# EAGLE design videobrick_alpha4 (EAGLE 6.6.0)

## Sheet 1 of 3
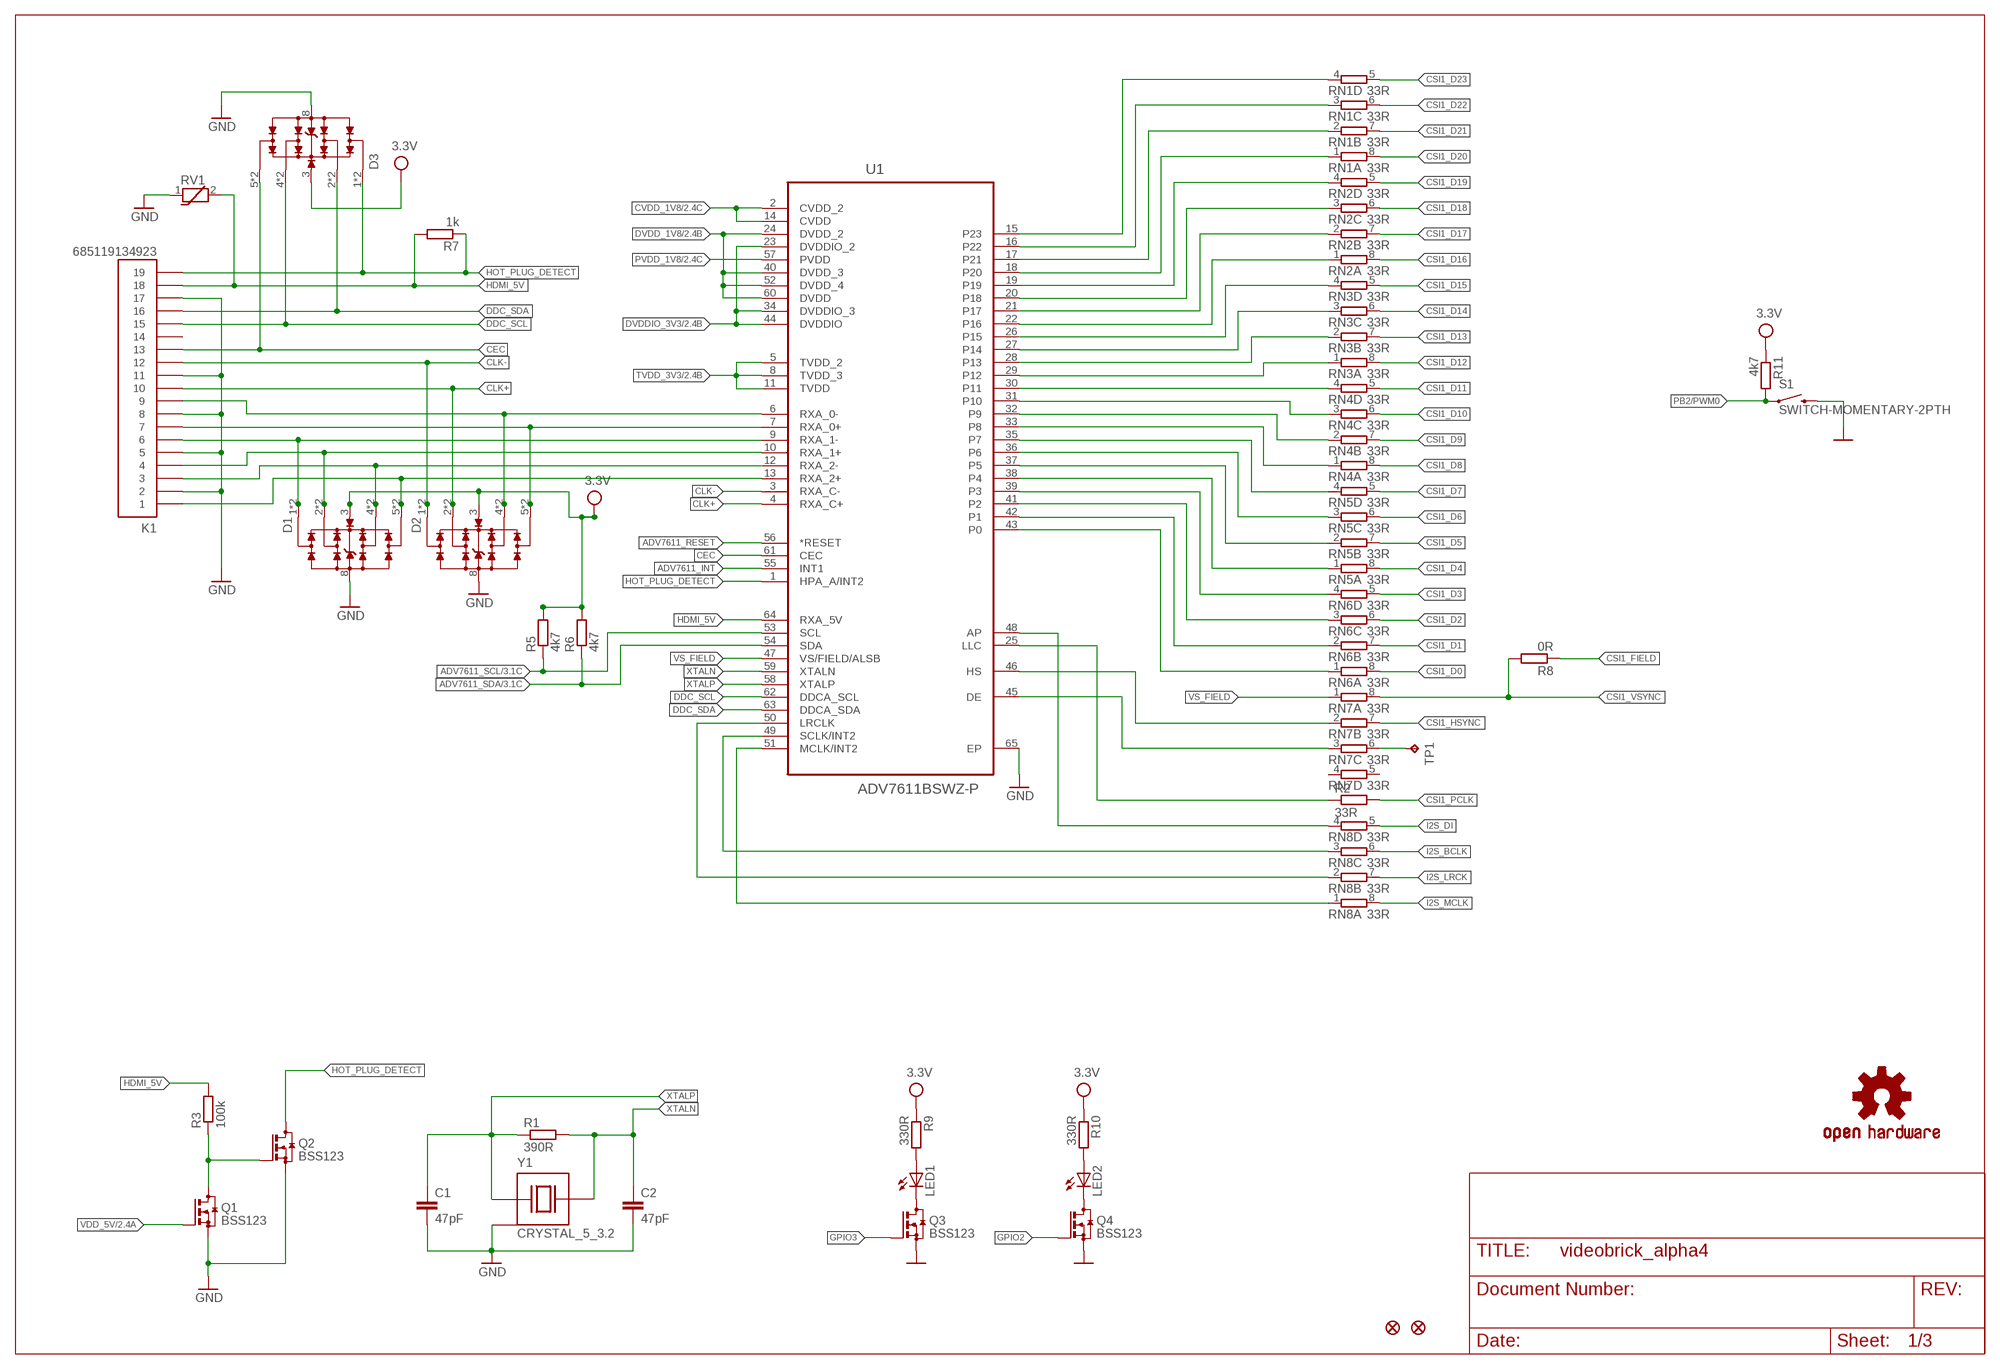
[diagram p0: schematic, sheet 1]

### Parts
C1  47pF  C-EUC0402  [C0402]
C2  47pF  C-EUC0402  [C0402]
D1  WE-TVS_82401444  [WE-TVS_MSOP-10L]
D2  WE-TVS_82401444  [WE-TVS_MSOP-10L]
D3  WE-TVS_82401444  [WE-TVS_MSOP-10L]
FID1  FIDUCIALUFIDUCIAL  [MICRO-FIDUCIAL]
FID2  FIDUCIAL1X2  [FIDUCIAL-1X2]
K1  685119134923  [685119134923]
LED1  LEDCHIPLED_0805  [CHIPLED_0805]
LED2  LEDCHIPLED_0805  [CHIPLED_0805]
LOGO1  OSHW-LOGOL  [OSHW-LOGO-L]
Q1  BSS123  [SOT23]
Q2  BSS123  [SOT23]
Q3  BSS123  [SOT23]
Q4  BSS123  [SOT23]
R1  390R  R-EU_R0402  [R0402]
R2  33R  R-EU_R0402  [R0402]
R3  100k  R-EU_R0402  [R0402]
R5  4k7  R-EU_R0402  [R0402]
R6  4k7  R-EU_R0402  [R0402]
R7  1k  R-EU_R0402  [R0402]
R8  0R  R-EU_R0402  [R0402]
R9  330R  R-EU_R0402  [R0402]
R10  330R  R-EU_R0402  [R0402]
R11  4k7  R-EU_R0402  [R0402]
RN1  33R  4R-N0402ARV341  [4X0402ARV341]
RN2  33R  4R-N0402ARV341  [4X0402ARV341]
RN3  33R  4R-N0402ARV341  [4X0402ARV341]
RN4  33R  4R-N0402ARV341  [4X0402ARV341]
RN5  33R  4R-N0402ARV341  [4X0402ARV341]
RN6  33R  4R-N0402ARV341  [4X0402ARV341]
RN7  33R  4R-N0402ARV341  [4X0402ARV341]
RN8  33R  4R-N0402ARV341  [4X0402ARV341]
RV1  WE-VS-82537040_0402  [WESURGE_0402]
S1  SWITCH-MOMENTARY-2PTH  [TACTILE-PTH]
TP1  TPTP06R  [TP06R]
U1  ADV7611BSWZ-P  [QFP50P1200X1200X160-65N]
Y1  CRYSTAL_5_3.2  [5MM_3.2MM]

### Nets
ADV7611_INT: U1.55(INT1) ; also sheet 3
ADV7611_RESET: U1.56(*RESET) ; also sheet 3
ADV7611_SCL: R5.1 U1.53(SCL) ; also sheet 3
ADV7611_SDA: R6.1 U1.54(SDA) ; also sheet 3
CEC: D3.5 D3.6 K1.13 U1.61(CEC)
CLK+: D2.2 D2.9 K1.10 U1.4(RXA_C+)
CLK-: D2.1 D2.10 K1.12 U1.3(RXA_C-)
CSI1_D0: RN6.8 ; also sheet 3
CSI1_D1: RN6.7 ; also sheet 3
CSI1_D2: RN6.6 ; also sheet 3
CSI1_D3: RN6.5 ; also sheet 3
CSI1_D4: RN5.8 ; also sheet 3
CSI1_D5: RN5.7 ; also sheet 3
CSI1_D6: RN5.6 ; also sheet 3
CSI1_D7: RN5.5 ; also sheet 3
CSI1_D8: RN4.8 ; also sheet 3
CSI1_D9: RN4.7 ; also sheet 3
CSI1_D10: RN4.6 ; also sheet 3
CSI1_D11: RN4.5 ; also sheet 3
CSI1_D12: RN3.8 ; also sheet 3
CSI1_D13: RN3.7 ; also sheet 3
CSI1_D14: RN3.6 ; also sheet 3
CSI1_D15: RN3.5 ; also sheet 3
CSI1_D16: RN2.8 ; also sheet 3
CSI1_D17: RN2.7 ; also sheet 3
CSI1_D18: RN2.6 ; also sheet 3
CSI1_D19: RN2.5 ; also sheet 3
CSI1_D20: RN1.8 ; also sheet 3
CSI1_D21: RN1.7 ; also sheet 3
CSI1_D22: RN1.6 ; also sheet 3
CSI1_D23: RN1.5 ; also sheet 3
CSI1_FIELD: R8.1 ; also sheet 3
CSI1_HSYNC: RN7.7 ; also sheet 3
CSI1_PCLK: R2.2 ; also sheet 3
CSI1_VSYNC: R8.2 RN7.8 ; also sheet 3
CVDD_1V8: U1.2(CVDD_2) U1.14(CVDD) ; also sheet 2
DDC_SCL: D3.4 D3.7 K1.15 U1.62(DDCA_SCL)
DDC_SDA: D3.2 D3.9 K1.16 U1.63(DDCA_SDA)
DVDD_1V8: U1.24(DVDD_2) U1.40(DVDD_3) U1.52(DVDD_4) U1.60(DVDD) ; also sheet 2
DVDDIO_3V3: U1.23(DVDDIO_2) U1.34(DVDDIO_3) U1.44(DVDDIO) ; also sheet 2
GND: C1.2 C2.2 D1.8(GND) D2.8(GND) D3.8(GND) K1.2 K1.5 K1.8 K1.11 K1.17 Q1.2(S) Q2.2(S) Q3.2(S) Q4.2(S) RV1.1 S1.3 U1.65(EP) Y1.P$2 Y1.P$4# ; also sheet 2,3
GPIO2: Q4.1(G) ; also sheet 3
GPIO3: Q3.1(G) ; also sheet 3
HDMI_5V: K1.18 R3.2 R7.2 RV1.2 U1.64(RXA_5V)
HOT_PLUG_DETECT: D3.1 D3.10 K1.19 Q2.3(D) R7.1 U1.1(HPA_A/INT2)
I2S_BCLK: RN8.6 ; also sheet 3
I2S_DI: RN8.5 ; also sheet 3
I2S_LRCK: RN8.7 ; also sheet 3
I2S_MCLK: RN8.8 ; also sheet 3
N$1: D1.5 D1.6 K1.1 U1.13(RXA_2+)
N$2: D1.4 D1.7 K1.3 U1.12(RXA_2-)
N$3: D1.2 D1.9 K1.4 U1.10(RXA_1+)
N$4: D1.1 D1.10 K1.6 U1.9(RXA_1-)
N$5: D2.5 D2.6 K1.7 U1.7(RXA_0+)
N$6: D2.4 D2.7 K1.9 U1.6(RXA_0-)
N$7: RN1.4 U1.15(P23)
N$8: RN1.3 U1.16(P22)
N$9: RN1.2 U1.17(P21)
N$10: RN1.1 U1.18(P20)
N$11: RN2.4 U1.19
N$12: RN2.3 U1.20(P18)
N$13: RN2.2 U1.21(P17)
N$14: RN2.1 U1.22(P16)
N$15: RN3.4 U1.26(P15)
N$16: RN3.3 U1.27(P14)
N$17: RN3.2 U1.28(P13)
N$18: RN3.1 U1.29(P12)
N$19: RN4.4 U1.30(P11)
N$20: RN4.3 U1.31(P10)
N$21: RN4.2 U1.32(P9)
N$22: RN4.1 U1.33(P8)
N$23: RN5.4 U1.35(P7)
N$24: RN5.3 U1.36(P6)
N$25: RN5.2 U1.37(P5)
N$26: RN5.1 U1.38(P4)
N$27: RN6.4 U1.39(P3)
N$28: RN6.3 U1.41(P2)
N$29: RN6.2 U1.42(P1)
N$30: RN6.1 U1.43(P0)
N$31: RN8.4 U1.48(AP)
N$32: RN7.2 U1.46(HS)
N$33: RN7.3 U1.45(DE)
N$34: R2.1 U1.25(LLC)
N$35: RN8.3 U1.49(SCLK/INT2)
N$36: Q1.3(D) Q2.1(G) R3.1
N$37: RN8.2 U1.50(LRCLK)
N$38: RN8.1 U1.51(MCLK/INT2)
N$40: LED1.C Q3.3(D)
N$41: LED1.A R9.2
N$43: LED2.A R10.2
N$44: LED2.C Q4.3(D)
N$47: RN7.6 TP1.TP
PB2/PWM0: R11.2 S1.1 ; also sheet 3
PVDD_1V8: U1.57(PVDD) ; also sheet 2
TVDD_3V3: U1.5(TVDD_2) U1.8(TVDD_3) U1.11(TVDD) ; also sheet 2
VCC: D1.3(VDD) D2.3(VDD) D3.3(VDD) R5.2 R6.2 R9.1 R10.1 R11.1 ; supply symbol labelled 3.3V ; also sheet 2,3
VDD_5V: Q1.1(G) ; also sheet 2
VS_FIELD: RN7.1 U1.47(VS/FIELD/ALSB)
XTALN: C2.1 R1.2 U1.59(XTALN) Y1.P$3
XTALP: C1.1 R1.1 U1.58(XTALP) Y1.P$1
Unconnected: K1.14 RN7.4 RN7.5

## Sheet 2 of 3: Power
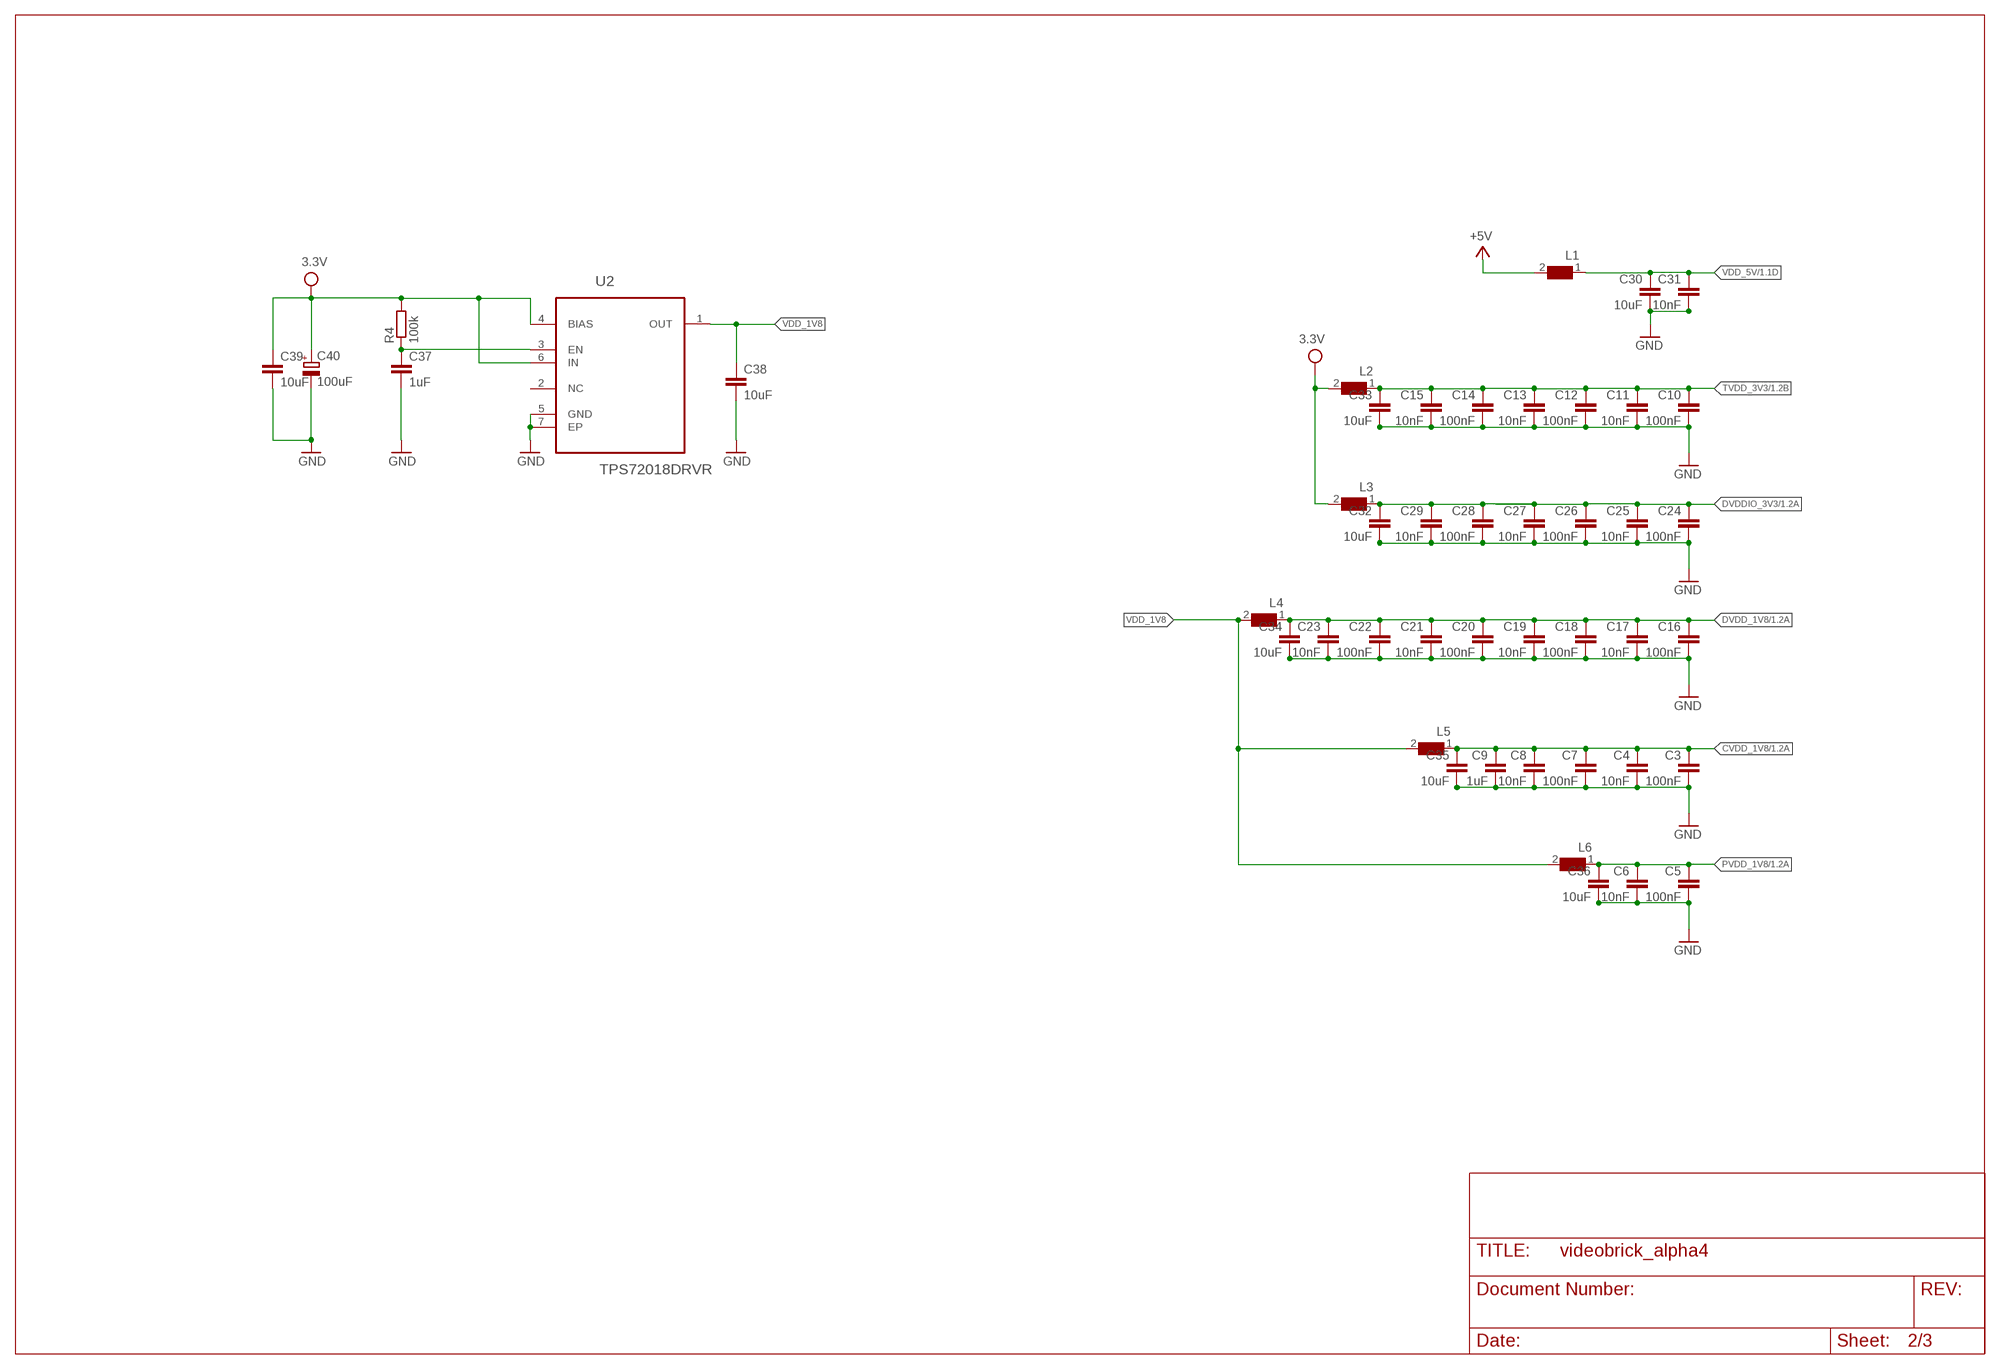
[diagram p1: schematic, sheet 2]

### Parts
C3  100nF  C-EUC0402  [C0402]
C4  10nF  C-EUC0402  [C0402]
C5  100nF  C-EUC0402  [C0402]
C6  10nF  C-EUC0402  [C0402]
C7  100nF  C-EUC0402  [C0402]
C8  10nF  C-EUC0402  [C0402]
C9  1uF  C-EUC0603  [C0603]
C10  100nF  C-EUC0402  [C0402]
C11  10nF  C-EUC0402  [C0402]
C12  100nF  C-EUC0402  [C0402]
C13  10nF  C-EUC0402  [C0402]
C14  100nF  C-EUC0402  [C0402]
C15  10nF  C-EUC0402  [C0402]
C16  100nF  C-EUC0402  [C0402]
C17  10nF  C-EUC0402  [C0402]
C18  100nF  C-EUC0402  [C0402]
C19  10nF  C-EUC0402  [C0402]
C20  100nF  C-EUC0402  [C0402]
C21  10nF  C-EUC0402  [C0402]
C22  100nF  C-EUC0402  [C0402]
C23  10nF  C-EUC0402  [C0402]
C24  100nF  C-EUC0402  [C0402]
C25  10nF  C-EUC0402  [C0402]
C26  100nF  C-EUC0402  [C0402]
C27  10nF  C-EUC0402  [C0402]
C28  100nF  C-EUC0402  [C0402]
C29  10nF  C-EUC0402  [C0402]
C30  10uF  C-EUC0805  [C0805]
C31  10nF  C-EUC0402  [C0402]
C32  10uF  C-EUC0805  [C0805]
C33  10uF  C-EUC0805  [C0805]
C34  10uF  C-EUC0805  [C0805]
C35  10uF  C-EUC0805  [C0805]
C36  10uF  C-EUC0805  [C0805]
C37  1uF  C-EUC0603  [C0603]
C38  10uF  C-EUC0805  [C0805]
C39  10uF  C-EUC0805  [C0805]
C40  100uF  CPOL-EU153CLV-0405  [153CLV-0405]
L1  WE-CBF-742792040_0805  [0805]
L2  WE-CBF-742792040_0805  [0805]
L3  WE-CBF-742792040_0805  [0805]
L4  WE-CBF-742792040_0805  [0805]
L5  WE-CBF-742792040_0805  [0805]
L6  WE-CBF-742792040_0805  [0805]
R4  100k  R-EU_R0402  [R0402]
U2  TPS72018DRVR  [SON65P200X200X80-7N]

### Nets
+5V: L1.2 ; also sheet 3
CVDD_1V8: C3.1 C4.1 C7.1 C8.1 C9.1 C35.1 L5.1 ; also sheet 1
DVDD_1V8: C16.1 C17.1 C18.1 C19.1 C20.1 C21.1 C22.1 C23.1 C34.1 L4.1 ; also sheet 1
DVDDIO_3V3: C24.1 C25.1 C26.1 C27.1 C28.1 C29.1 C32.1 L3.1 ; also sheet 1
GND: C3.2 C4.2 C5.2 C6.2 C7.2 C8.2 C9.2 C10.2 C11.2 C12.2 C13.2 C14.2 C15.2 C16.2 C17.2 C18.2 C19.2 C20.2 C21.2 C22.2 C23.2 C24.2 C25.2 C26.2 C27.2 C28.2 C29.2 C30.2 C31.2 C32.2 C33.2 C34.2 C35.2 C36.2 C37.2 C38.2 C39.2 C40.- U2.5(GND) U2.7(EP) ; also sheet 1,3
N$39: C37.1 R4.1 U2.3(EN)
PVDD_1V8: C5.1 C6.1 C36.1 L6.1 ; also sheet 1
TVDD_3V3: C10.1 C11.1 C12.1 C13.1 C14.1 C15.1 C33.1 L2.1 ; also sheet 1
VCC: C39.1 C40.+ L2.2 L3.2 R4.2 U2.4(BIAS) U2.6(IN) ; supply symbol labelled 3.3V ; also sheet 1,3
VDD_1V8: C38.1 L4.2 L5.2 L6.2 U2.1(OUT)
VDD_5V: C30.1 C31.1 L1.1 ; also sheet 1
Unconnected: U2.2(NC)

## Sheet 3 of 3: Connector
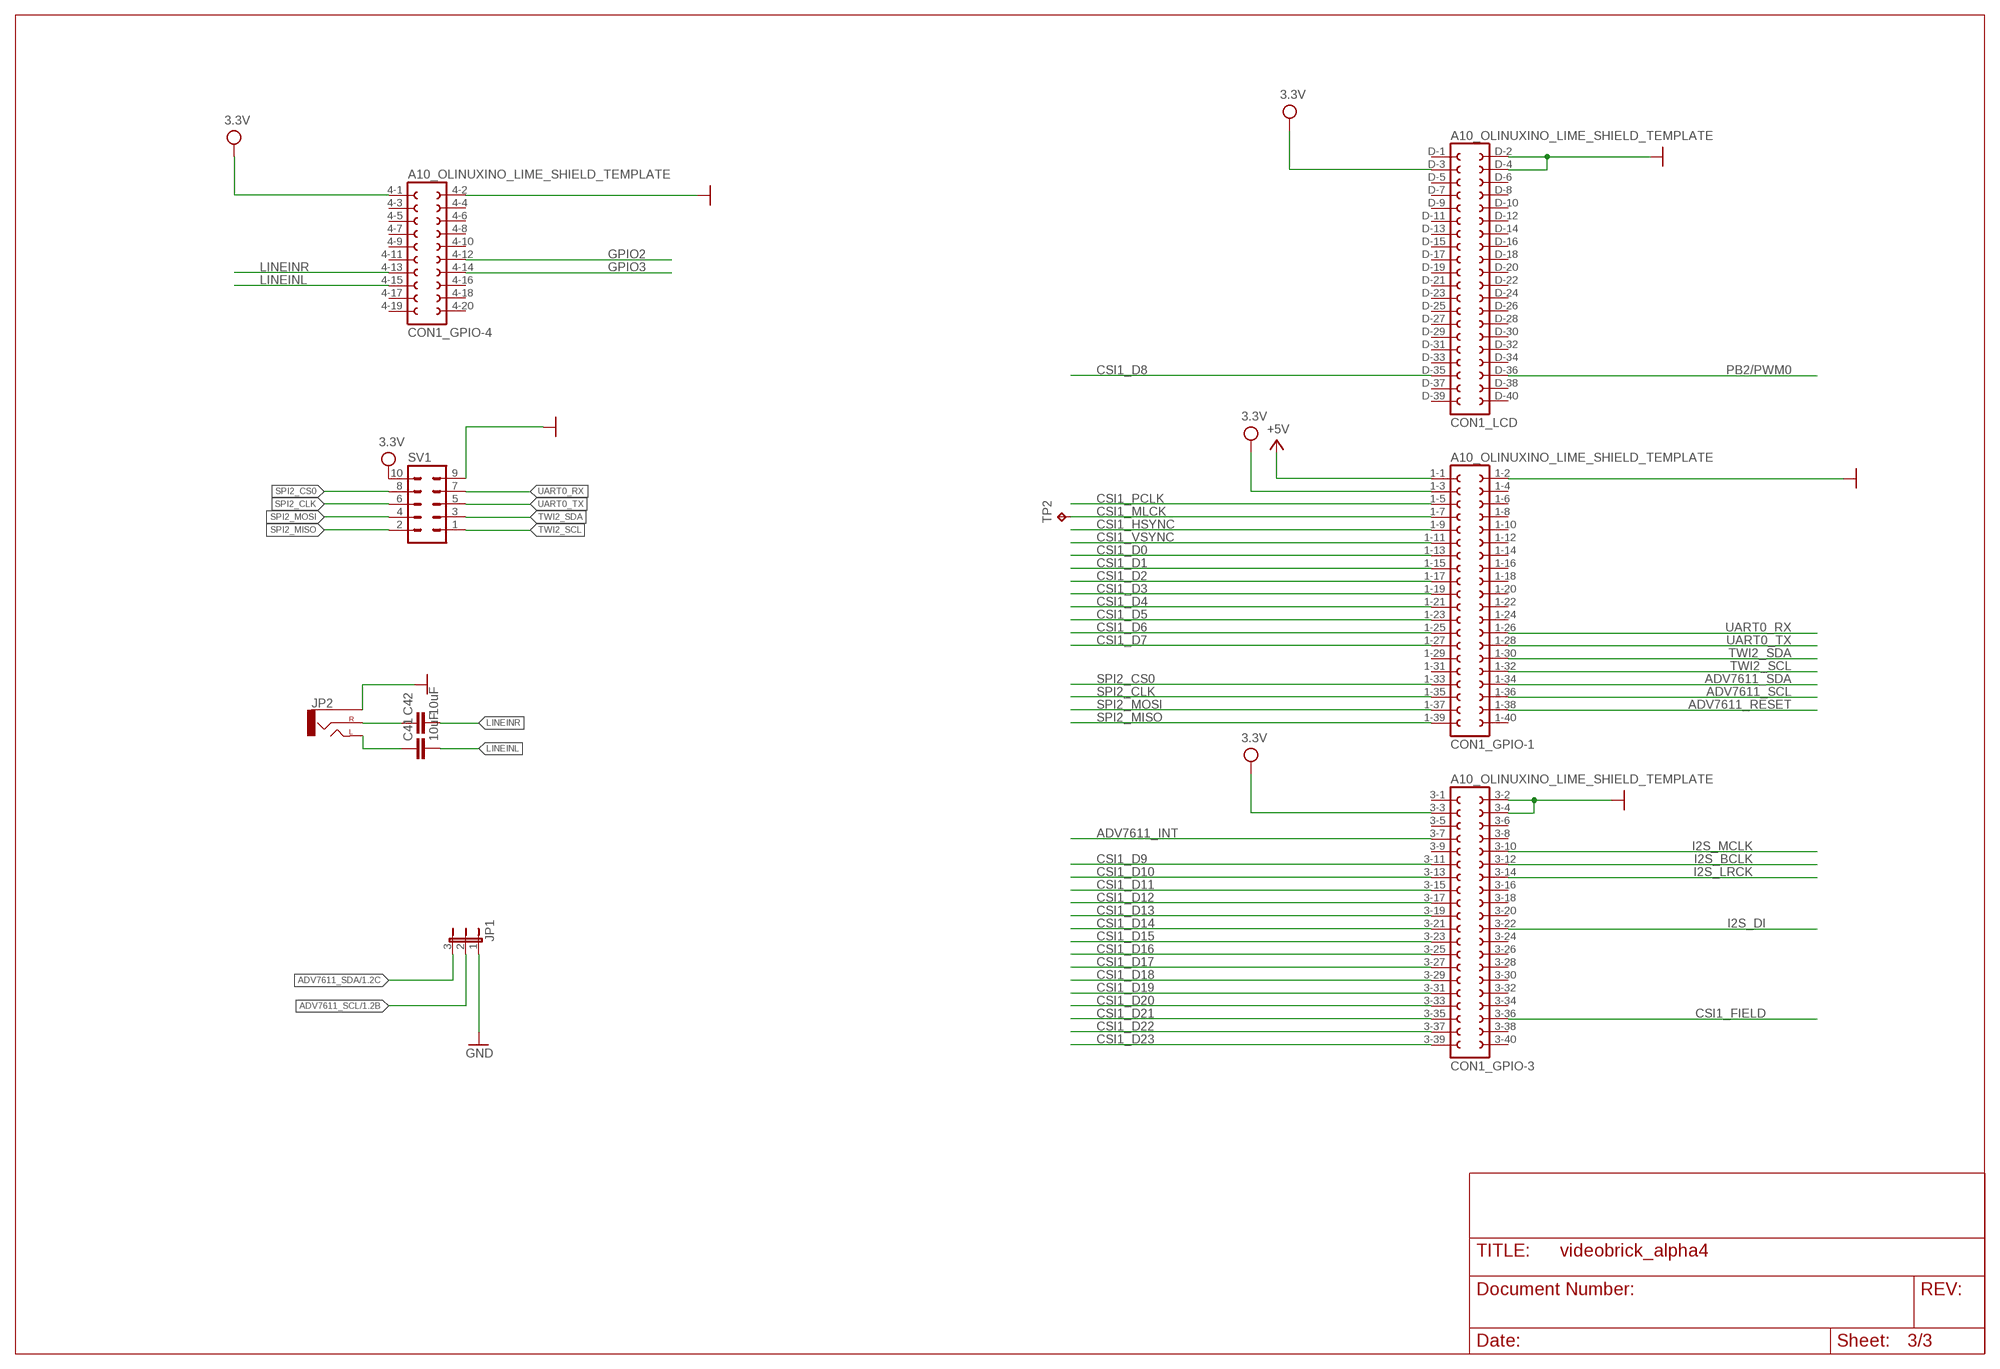
[diagram p2: schematic, sheet 3]

### Parts
C41  10uF  C-EUC0805  [C0805]
C42  10uF  C-EUC0805  [C0805]
CON1  A10_OLINUXINO_LIME_SHIELD_TEMPLATE  [A10_OLINUXINO_LIME_SHIELD]
JP1  JP2E  [JP2]
JP2  AUDIO-JACKPTH  [AUDIO-JACK]
SV1  MA05-2  [MA05-2]
TP2  TPTP06R  [TP06R]

### Nets
+5V: CON1.1-1 ; also sheet 2
ADV7611_INT: CON1.3-7 ; also sheet 1
ADV7611_RESET: CON1.1-38 ; also sheet 1
ADV7611_SCL: CON1.1-36 JP1.2 ; also sheet 1
ADV7611_SDA: CON1.1-34 JP1.3 ; also sheet 1
CSI1_D0: CON1.1-13 ; also sheet 1
CSI1_D1: CON1.1-15 ; also sheet 1
CSI1_D2: CON1.1-17 ; also sheet 1
CSI1_D3: CON1.1-19 ; also sheet 1
CSI1_D4: CON1.1-21 ; also sheet 1
CSI1_D5: CON1.1-23 ; also sheet 1
CSI1_D6: CON1.1-25 ; also sheet 1
CSI1_D7: CON1.1-27 ; also sheet 1
CSI1_D8: CON1.D-35 ; also sheet 1
CSI1_D9: CON1.3-11 ; also sheet 1
CSI1_D10: CON1.3-13 ; also sheet 1
CSI1_D11: CON1.3-15 ; also sheet 1
CSI1_D12: CON1.3-17 ; also sheet 1
CSI1_D13: CON1.3-19 ; also sheet 1
CSI1_D14: CON1.3-21 ; also sheet 1
CSI1_D15: CON1.3-23 ; also sheet 1
CSI1_D16: CON1.3-25 ; also sheet 1
CSI1_D17: CON1.3-27 ; also sheet 1
CSI1_D18: CON1.3-29 ; also sheet 1
CSI1_D19: CON1.3-31 ; also sheet 1
CSI1_D20: CON1.3-33 ; also sheet 1
CSI1_D21: CON1.3-35 ; also sheet 1
CSI1_D22: CON1.3-37 ; also sheet 1
CSI1_D23: CON1.3-39 ; also sheet 1
CSI1_FIELD: CON1.3-36 ; also sheet 1
CSI1_HSYNC: CON1.1-9 ; also sheet 1
CSI1_MLCK: CON1.1-7 TP2.TP
CSI1_PCLK: CON1.1-5 ; also sheet 1
CSI1_VSYNC: CON1.1-11 ; also sheet 1
GND: CON1.1-2 CON1.3-2 CON1.3-4 CON1.4-2 CON1.D-2 CON1.D-4 JP1.1 JP2.SLEEVE SV1.9 ; also sheet 1,2
GPIO2: CON1.4-12 ; also sheet 1
GPIO3: CON1.4-14 ; also sheet 1
I2S_BCLK: CON1.3-12 ; also sheet 1
I2S_DI: CON1.3-22 ; also sheet 1
I2S_LRCK: CON1.3-14 ; also sheet 1
I2S_MCLK: CON1.3-10 ; also sheet 1
LINEINL: C41.2 CON1.4-15
LINEINR: C42.2 CON1.4-13
N$45: C42.1 JP2.RING(RIGHT)
N$46: C41.1 JP2.TIP(LEFT)
PB2/PWM0: CON1.D-36 ; also sheet 1
SPI2_CLK: CON1.1-35 SV1.6
SPI2_CS0: CON1.1-33 SV1.8
SPI2_MISO: CON1.1-39 SV1.2
SPI2_MOSI: CON1.1-37 SV1.4
TWI2_SCL: CON1.1-32 SV1.1
TWI2_SDA: CON1.1-30 SV1.3
UART0_RX: CON1.1-26 SV1.7
UART0_TX: CON1.1-28 SV1.5
VCC: CON1.1-3 CON1.3-3 CON1.4-1 CON1.D-3 SV1.10 ; supply symbol labelled 3.3V ; also sheet 1,2
Unconnected: CON1.1-4 CON1.1-6 CON1.1-8 CON1.1-10 CON1.1-12 CON1.1-14 CON1.1-16 CON1.1-18 CON1.1-20 CON1.1-22 CON1.1-24 CON1.1-29 CON1.1-31 CON1.1-40 CON1.3-1 CON1.3-5 CON1.3-6 CON1.3-8 CON1.3-9 CON1.3-16 CON1.3-18 CON1.3-20 CON1.3-24 CON1.3-26 CON1.3-28 CON1.3-30 CON1.3-32 CON1.3-34 CON1.3-38 CON1.3-40 CON1.4-3 CON1.4-4 CON1.4-5 CON1.4-6 CON1.4-7 CON1.4-8 CON1.4-9 CON1.4-10 CON1.4-11 CON1.4-16 CON1.4-17 CON1.4-18 CON1.4-19 CON1.4-20 CON1.D-1 CON1.D-5 CON1.D-6 CON1.D-7 CON1.D-8 CON1.D-9 CON1.D-10 CON1.D-11 CON1.D-12 CON1.D-13 CON1.D-14 CON1.D-15 CON1.D-16 CON1.D-17 CON1.D-18 CON1.D-19 CON1.D-20 CON1.D-21 CON1.D-22 CON1.D-23 CON1.D-24 CON1.D-25 CON1.D-26 CON1.D-27 CON1.D-28 CON1.D-29 CON1.D-30 CON1.D-31 CON1.D-32 CON1.D-33 CON1.D-34 CON1.D-37 CON1.D-38 CON1.D-39 CON1.D-40

## Library data of the parts
C1-C39 C41 C42 = rcl:C-EU: CAPACITOR, European symbol
C40 = rcl:CPOL-EU: POLARIZED CAPACITOR, European symbol
CON1 = A10_OLIMEXINO_LIME_SHIELD:A10_OLINUXINO_LIME_SHIELD_TEMPLATE
D1-D3 = WE-TVS_82401444:WE-TVS_82401444: TVS Diode Array WE-TVS, Super Speed Serie - Low capazity - No leakage current - Low clamping voltage - high ESD voltage protection -- SATA -- DisplayPort -- DVI -- HDMI; MPN: 82401444; OC_FARNELL: 1825863; OC_NEWARK: 79R6952; PACKAGE: MSOP-10L; SUPPLIER: Wuerth Elektronik
FID1 FID2 = SparkFun-Aesthetics:FIDUCIAL: Fiducial Alignment Points Various fiducial points for machine vision alignment.
JP1 = jumper:JP2E: JUMPER
JP2 = SparkFun-Connectors:AUDIO-JACK: 3.5mm Audio Jack Simple 3.5mm common PCB mount audio jack. SKU: PRT-08032
K1 = InputOutputIO:685119134923: WR-COM SMT Horizontal HDMI, 19 pins
L1-L6 = WE-CBF:WE-CBF: SMD EMI Suppression Ferrite Beads WE-CBF - Excellent anti-EMI properties - Low DC-restistance - Impedances till 3000 ohms - Rated current up to 6 A -- Reliable Ni-Sn electrodes -- Perfect as data lined filter and for uncoupling of distribution voltage; MPN: 742792040; OC_FARNELL: 1635735; OC_NEWARK: 08P2371; PACKAGE: IND-0805; SUPPLIER: Wuerth Elektronik
LED1 LED2 = led:LED: LED OSRAM: - CHIPLED LG R971, LG N971, LY N971, LG Q971, LY Q971, LO R971, LY R971 LH N974, LH R974 LS Q976, LO Q976, LY Q976 LO Q996 - Hyper CHIPLED LW Q18S LB Q993, LB Q99A, LB R99A - SideLED LS A670, LO A670, LY A670, LG A670, LP A670 LB A673, LV A673, LT A673, LW A673 LH A674 LY A675 LS A676, LA A676, LO A676, LY A676, LW A676 LS A679, LY A679, LG A679 - Hyper Micro SIDELED® LS Y876, LA Y876, LO Y876, LY Y876 LT Y87S - SmartLED LW L88C, LW L88S LB L89C, LB L89S, LG L890 LS L89K, LO L89K, LY L89K LS L896, LA L896, LO L896, LY L896 - TOPLED LS T670, LO T670, LY T670, LG T670, LP T670 LSG T670, LSP T670, LSY T670, LOP T670, LYG T670 LG T671, LOG T671, LSG T671 LB T673, LV T673, LT T673, LW T673 LH T674 LS T676, LA T676, LO T676, LY T676, LB T676, LH T676, LSB T676, LW T676 LB T67C, LV T67C, LT T67C, LS T67K, LO T67K, LY T67K, LW E67C LS E67B, LA E67B, LO E67B, LY E67B, LB E67C, LV E67C, LT E67C LW T67C LS T679, LY T679, LG T679 LS T770, LO T770, LY T770, LG T770, LP T770 LB T773, LV T773, LT T773, LW T773 LH T774 LS E675, LA E675, LY E675, LS T675 LS T776, LA T776, LO T776, LY T776, LB T776 LHGB T686 LT T68C, LB T68C - Hyper Mini TOPLED® LB M676 - Mini TOPLED Santana® LG M470 LS M47K, LO M47K, LY M47K Source: http://www.osram.convergy.de LUXEON: - LUMILED® LXK2-PW12-R00, LXK2-PW12-S00, LXK2-PW14-U00, LXK2-PW14-V00 LXK2-PM12-R00, LXK2-PM12-S00, LXK2-PM14-U00 LXK2-PE12-Q00, LXK2-PE12-R00, LXK2-PE12-S00, LXK2-PE14-T00, LXK2-PE14-U00 LXK2-PB12-K00, LXK2-PB12-L00, LXK2-PB12-M00, LXK2-PB14-N00, LXK2-PB14-P00, LXK2-PB14-Q00 LXK2-PR12-L00, LXK2-PR12-M00, LXK2-PR14-Q00, LXK2-PR14-R00 LXK2-PD12-Q00, LXK2-PD12-R00, LXK2-PD12-S00 LXK2-PH12-R00, LXK2-PH12-S00 LXK2-PL12-P00, LXK2-PL12-Q00, LXK2-PL12-R00 Source: www.luxeon.com KINGBRIGHT: KA-3528ASYC Source: www.kingbright.com
LOGO1 = SparkFun-Aesthetics:OSHW-LOGO: Open Source Hardware Logo This logo indicates the piece of hardware it is found on incorporates a OSHW license and/or adheres to the definition of open source hardware found here: http://freedomdefined.org/OSHW
Q1-Q4 = transistor-small-signal:BSS123: N-CHANNEL MOS FET
R1-R11 = resistor:R-EU_: RESISTOR, European symbol
RN1-RN8 = resistor-dil:4R-N: Array Chip Resistor Source: RS Component / Phycomp; OC_FARNELL: unknown; OC_NEWARK: unknown
RV1 = WE-VS:WE-VS: WESURGE SMD Varistor WE-VS - Fast response time - Low leakage current - Low clamping voltage - Wide range of voltage avaible - Almost no energy consumption in stand-by mode - Excellent absorption at surge-impulses - Nickel barrier for leadfree soldering - Operating temperature: -40°C to +85°C for size 0402 to 0805; -40°C to +1255°C for size 1206 to 2220 -- Protection of DC distribution -- Protection of power supply -- Protection of semiconductors -- Protection of bus systems and communication lines -- Limiting of over-voltage -- ESD protection in accordance with EN 61000-4-2 and Surge protection in accordance with EN 61000-4-5; MPN: 82537040; OC_FARNELL: 1636429; OC_NEWARK: 08P3016; PACKAGE: 0402; SUPPLIER: WURTH ELEKTRONIK
S1 = SparkFun-Electromechanical:SWITCH-MOMENTARY-2: Various NO switches- pushbuttons, reed, etc
SV1 = con-lstb:MA05-2: PIN HEADER; OC_FARNELL: unknown; OC_NEWARK: unknown
TP1 TP2 = testpad:TP: Test pad
U1 = ADI-Phase-2:ADV7611BSWZ-P: Low Power 165 MHz HDMI Receiver,LQFP-64; MPN: ADV7611BSWZ-P; OC_FARNELL: 1903660; OC_NEWARK: 45T0201; PACKAGE: LQFP-64; SUPPLIER: Analog Devices
U2 = Texas Instruments_By_element14_Batch_1:TPS72018DRVR: 350mA, Ultra-Low VIN, RF Low-Dropout Linear Regulator with Bias Pin; MPN: TPS72018DRVR; OC_FARNELL: -; OC_NEWARK: 69R0453; PACKAGE: SON-6; SUPPLIER: Texas Instruments
Y1 = xtals:CRYSTAL_5_3.2

## Board
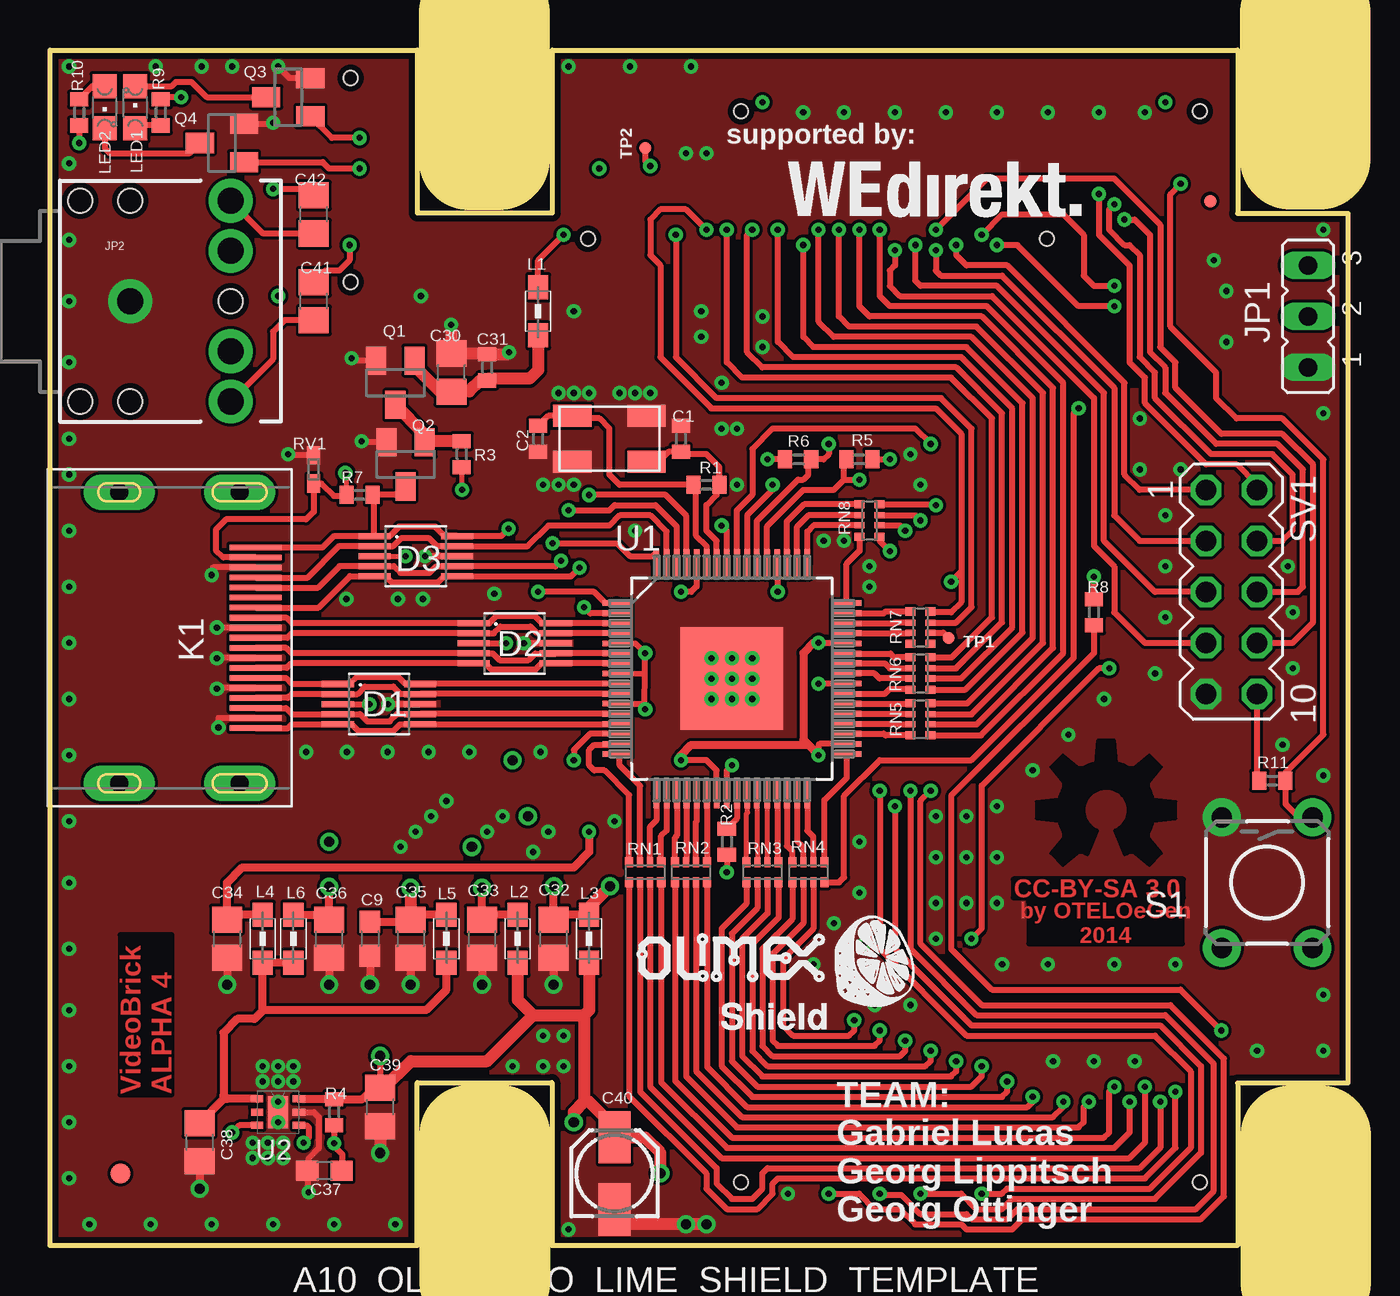
[diagram p3: board, top side]
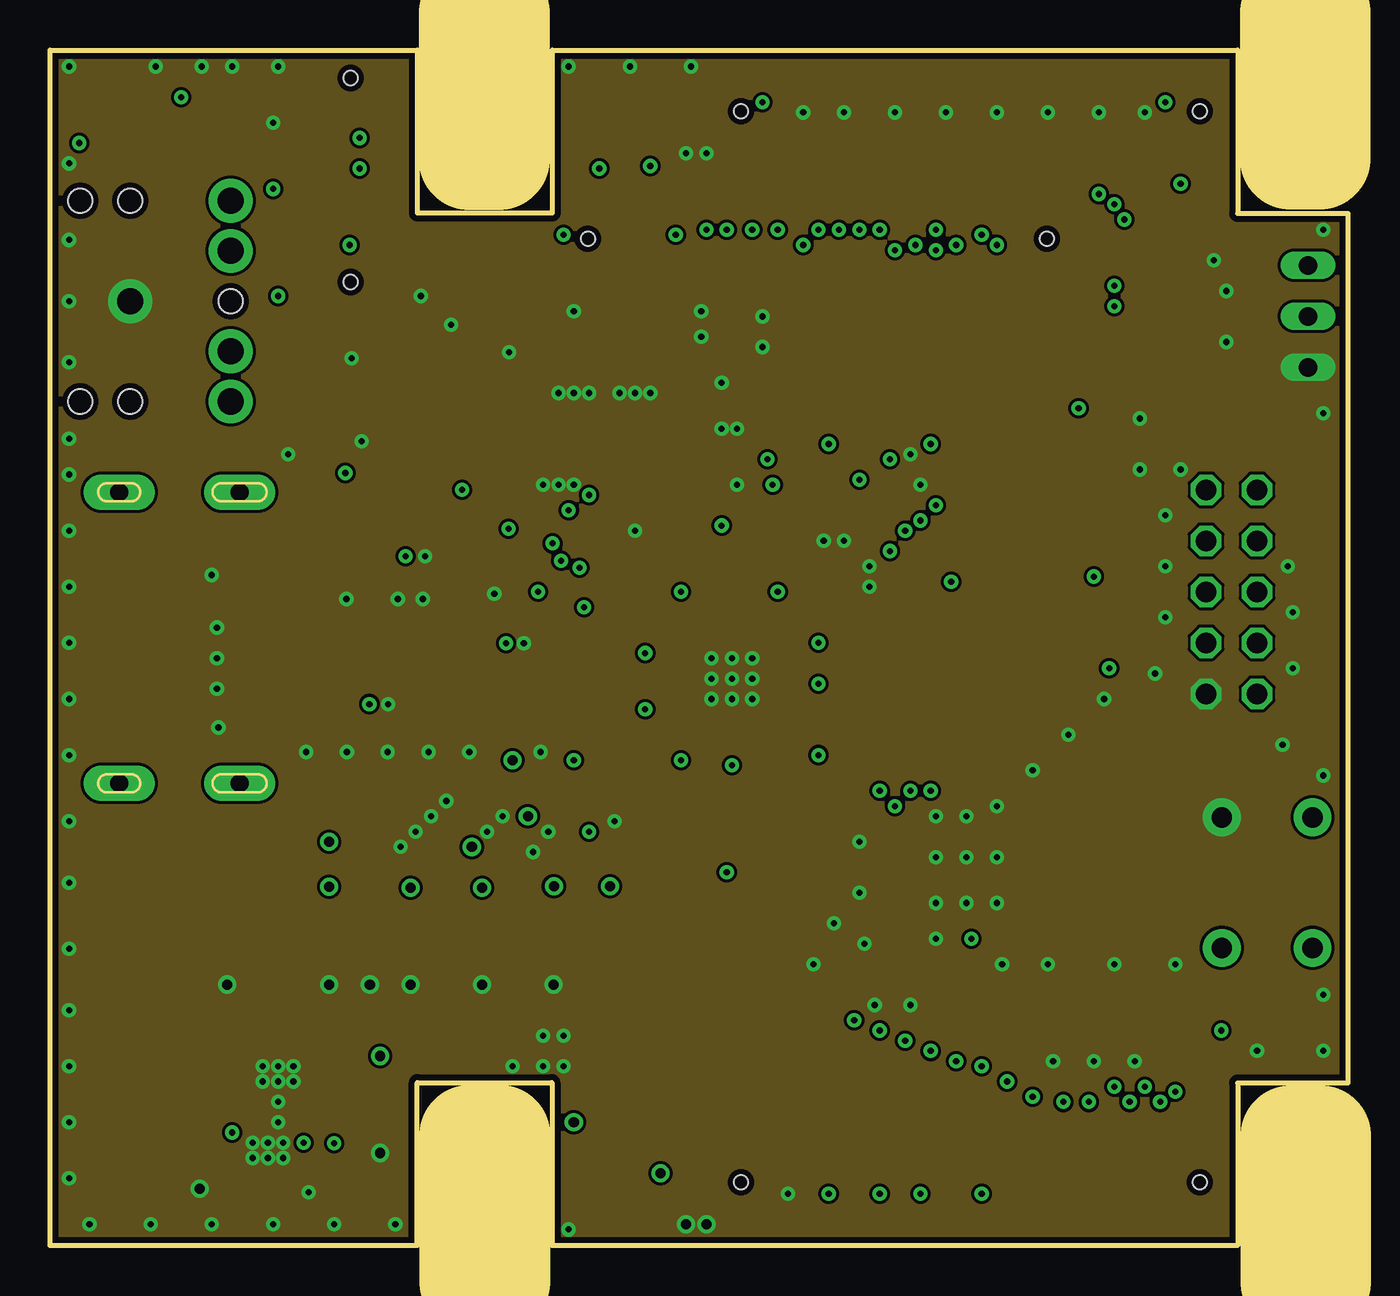
[diagram p4: board, inner layer Route2]
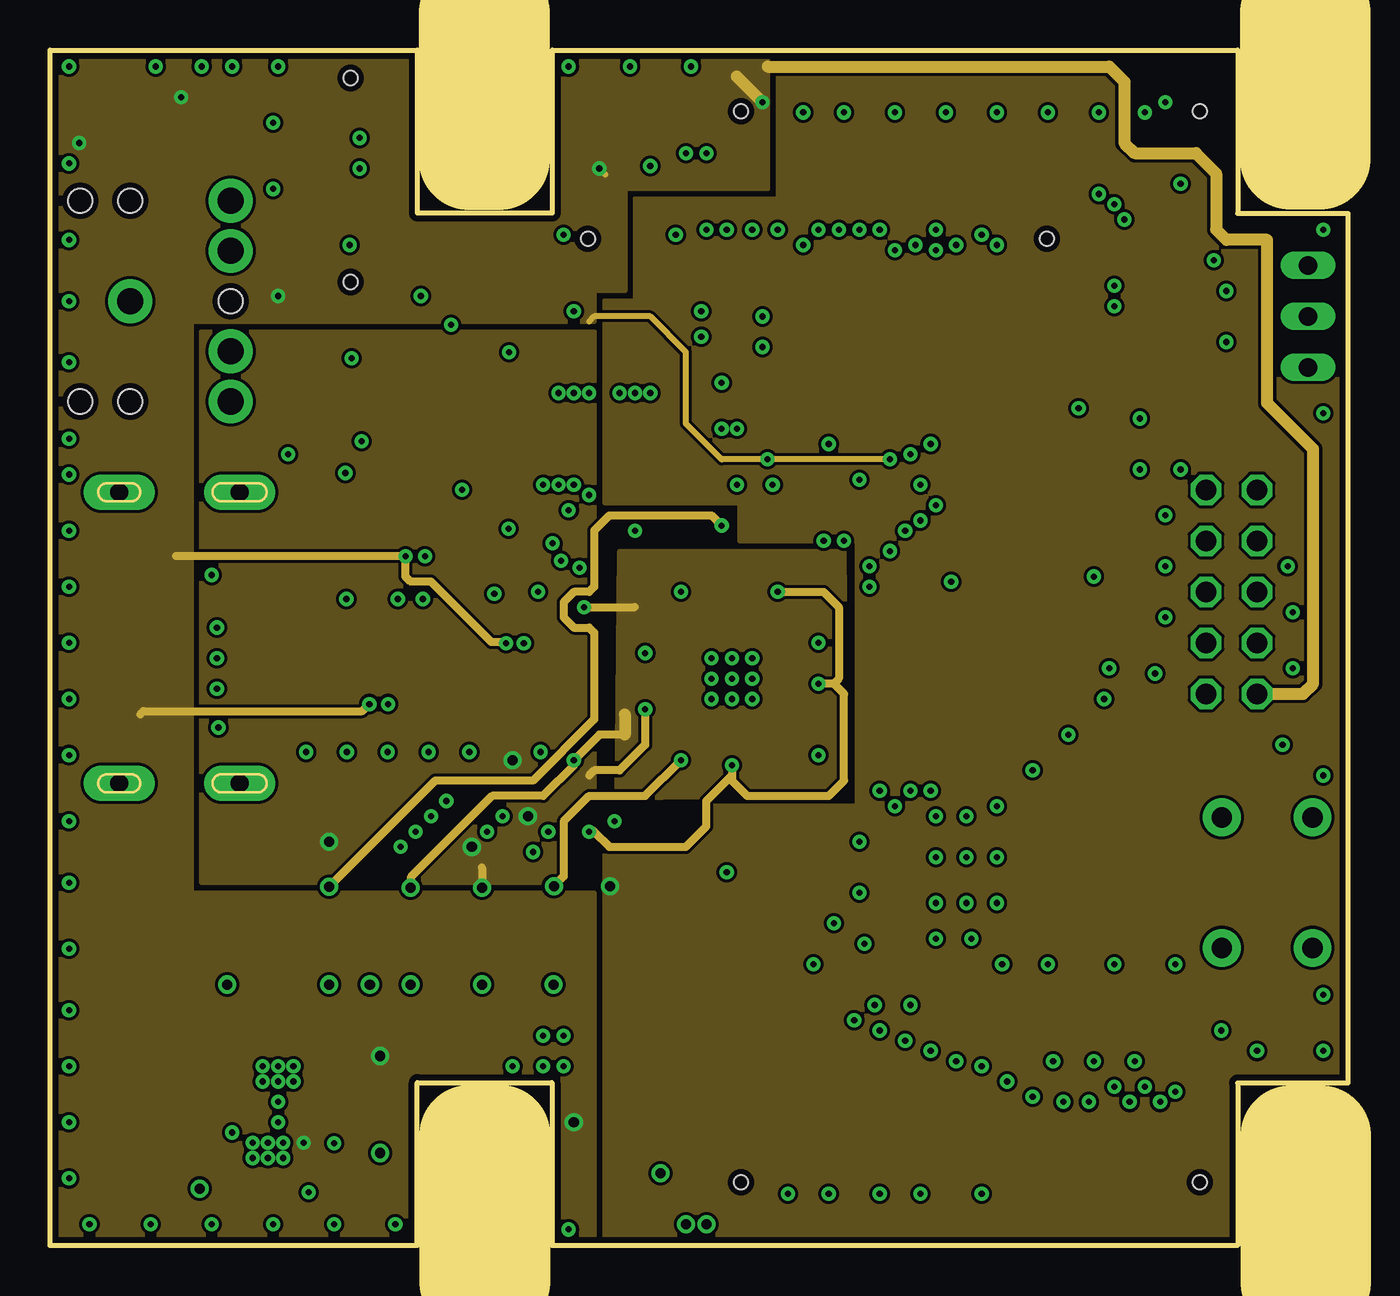
[diagram p5: board, inner layer Route15]
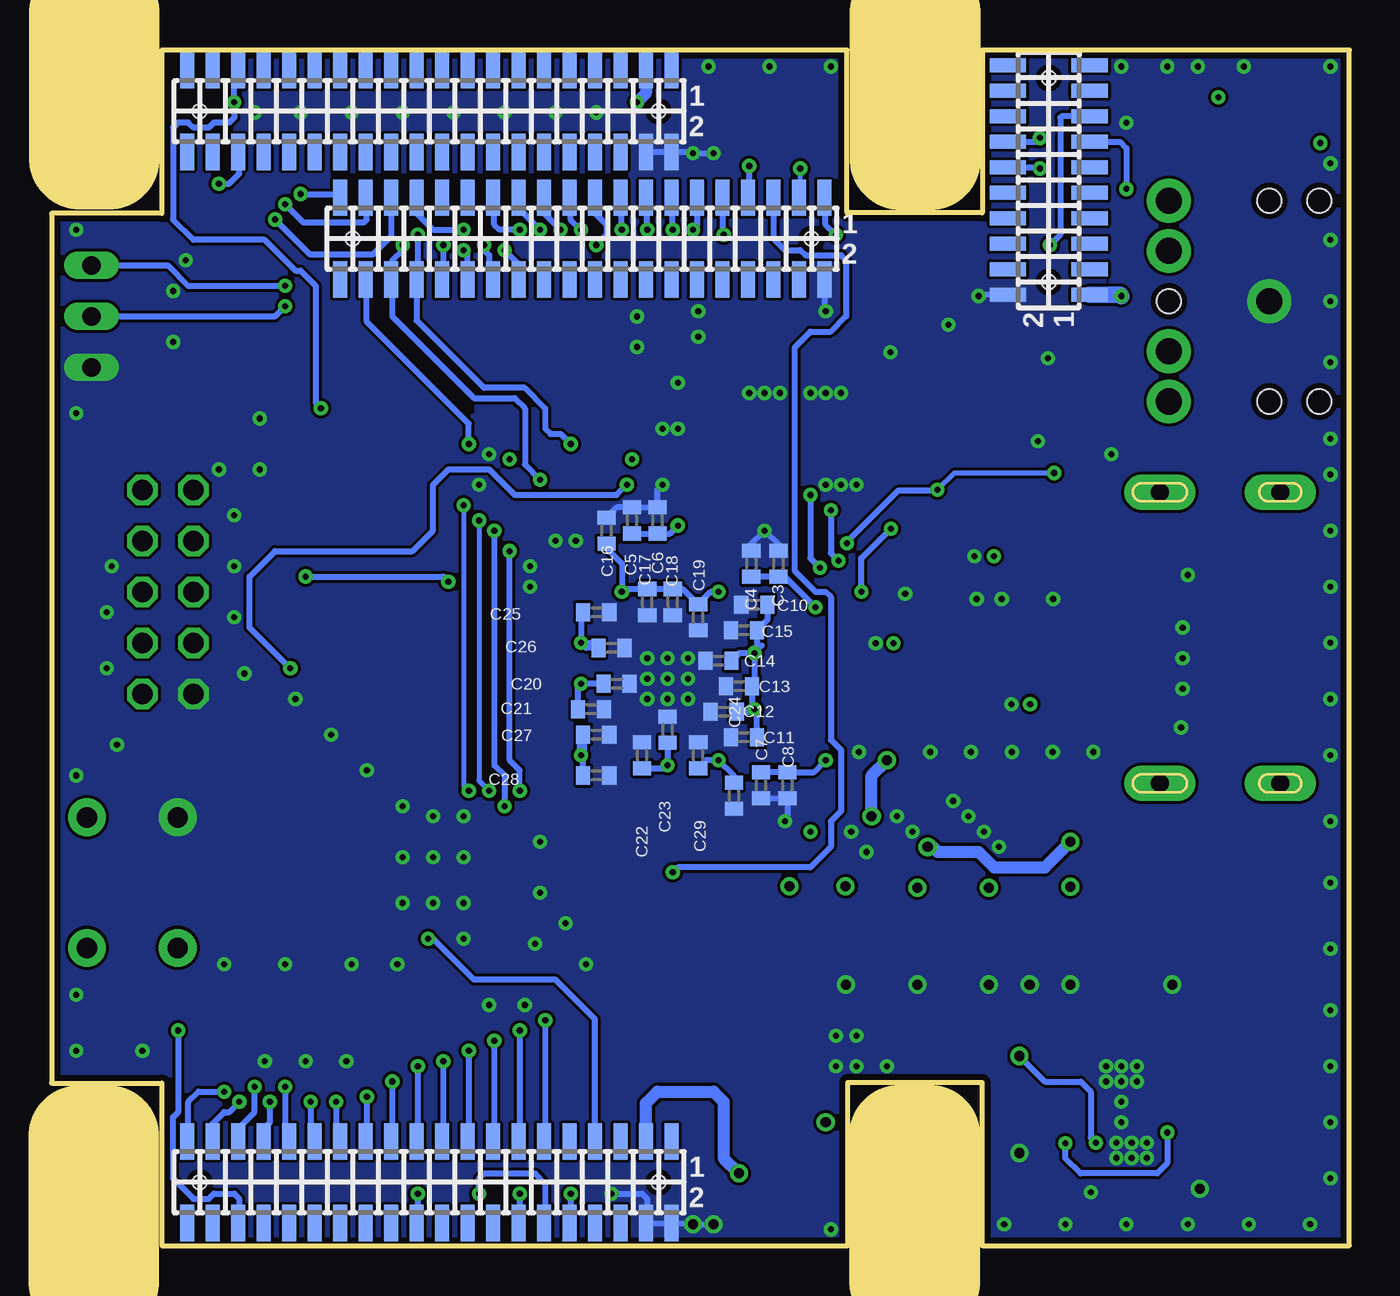
[diagram p6: board, bottom side, seen from below]

Size 64.64 x 59.54 mm. Coordinates in mm from the lower left corner, seen from the top.
Outline: 0,59.54 18.29,59.54 18.29,51.43 25.02,51.43 25.02,59.54 59.16,59.54 59.16,51.41 64.64,51.41 64.64,8.1 59.16,8.1 59.16,0 24.99,0 24.99,8.13 18.29,8.13 18.29,0 0,0 0,59.54
Copper layers (1*2+15*16): Top 0.035mm / dielectric 0.2mm / Route2 0.035mm / dielectric 1.01mm / Route15 0.035mm / dielectric 0.2mm / Bottom 0.035mm
Design rules "Eagle_WEdirekt_150_check *": minimum track width 0.15mm, minimum drill 0.2mm, track to track 0.15mm, track to pad 0.15mm, pad to pad 0.2mm, via to via 0.15mm, smd to smd 0.2mm, copper to edge 0.3mm, drill to drill 0.6mm, minimum pad ring 0.225mm, minimum via ring 0.2mm, stop-mask expansion 0.075mm, vias tented up to drill 0mil, thermal gap 0.3mm
tRestrict: area 19.5,26.7 to 27.4,27.2; area 26.1,29.8 to 27.4,30.3; area 34,49.8 to 34.5,50.1; area 36.5,49.6 to 37.3,50.1; area 53.5,42.7 to 54.5,43.2; area 44.4,14 to 45.1,14.5
bRestrict: area 43.6,41.5 to 44.1,42; area 36,53.1 to 50.7,53.4
Milling: area 61.8,54.1 to 63.3,61.4; area 20.9,54.1 to 22.4,61.4; area 61.8,-1.8 to 63.3,5.5; area 20.9,-1.8 to 22.4,5.5

### Footprints (pad centres in the part's own frame; a part is rotated, then mirrored left to right if it is on the bottom)
C0402 = smd 0.7 x 0.9: 1 -0.65,0; 2 0.65,0
C0603 = smd 1.1 x 1: 1 -0.85,0; 2 0.85,0
C0805 = smd 1.3 x 1.5: 1 -0.95,0; 2 0.95,0
153CLV-0405 = smd 2.6 x 1.6: + 1.8,0; - -1.8,0
A10_OLINUXINO_LIME_SHIELD = smd 0.7 x 1.8 bottom: 1-1 -11.874,22.416; 1-2 -11.874,18.352; 1-3 -10.604,22.416; 1-4 -10.604,18.352; 1-5 -9.335,22.416; 1-6 -9.335,18.352; 1-7 -8.065,22.416; 1-8 -8.065,18.352; 1-9 -6.795,22.416; 1-10 -6.795,18.352; 1-11 -5.524,22.416; 1-12 -5.524,18.352; 1-13 -4.255,22.416; 1-14 -4.255,18.352; 1-15 -2.985,22.416; 1-16 -2.985,18.352; 1-17 -1.714,22.416; 1-18 -1.714,18.352; 1-19 -0.445,22.416; 1-20 -0.445,18.352; 1-21 0.826,22.416; 1-22 0.826,18.352; 1-23 2.095,22.416; 1-24 2.095,18.352; 1-25 3.365,22.416; 1-26 3.365,18.352; 1-27 4.636,22.416; 1-28 4.636,18.352; 1-29 5.905,22.416; 1-30 5.905,18.352; 1-31 7.176,22.416; 1-32 7.176,18.352; 1-33 8.445,22.416; 1-34 8.445,18.352; 1-35 9.716,22.416; 1-36 9.716,18.352; 1-37 10.986,22.416; 1-38 10.986,18.352; 1-39 12.255,22.416; 1-40 12.255,18.352; 3-1 -4.255,-24.575; 3-2 -4.255,-28.639; 3-3 -2.985,-24.575; 3-4 -2.985,-28.639; 3-5 -1.714,-24.575; 3-6 -1.714,-28.639; 3-7 -0.445,-24.575; 3-8 -0.445,-28.639; 3-9 0.826,-24.575; 3-10 0.826,-28.639; 3-11 2.095,-24.575; 3-12 2.095,-28.639; 3-13 3.365,-24.575; 3-14 3.365,-28.639; 3-15 4.636,-24.575; 3-16 4.636,-28.639; 3-17 5.905,-24.575; 3-18 5.905,-28.639; 3-19 7.176,-24.575; 3-20 7.176,-28.639; 3-21 8.445,-24.575; 3-22 8.445,-28.639; 3-23 9.716,-24.575; 3-24 9.716,-28.639; 3-25 10.986,-24.575; 3-26 10.986,-28.639; 3-27 12.255,-24.575; 3-28 12.255,-28.639; 3-29 13.525,-24.575; 3-30 13.525,-28.639; 3-31 14.796,-24.575; 3-32 14.796,-28.639; 3-33 16.066,-24.575; 3-34 16.066,-28.639; 3-35 17.335,-24.575; 3-36 17.335,-28.639; 3-37 18.605,-24.575; 3-38 18.605,-28.639; 3-39 19.875,-24.575; 3-40 19.875,-28.639; D-1 -4.255,28.765; D-2 -4.255,24.701; D-3 -2.985,28.765; D-4 -2.985,24.701; D-5 -1.714,28.765; D-6 -1.714,24.701; D-7 -0.445,28.765; D-8 -0.445,24.701; D-9 0.826,28.765; D-10 0.826,24.701; D-11 2.095,28.765; D-12 2.095,24.701; D-13 3.365,28.765; D-14 3.365,24.701; D-15 4.636,28.765; D-16 4.636,24.701; D-17 5.905,28.765; D-18 5.905,24.701; D-19 7.176,28.765; D-20 7.176,24.701; D-21 8.445,28.765; D-22 8.445,24.701; D-23 9.716,28.765; D-24 9.716,24.701; D-25 10.986,28.765; D-26 10.986,24.701; D-27 12.255,28.765; D-28 12.255,24.701; D-29 13.525,28.765; D-30 13.525,24.701; D-31 14.796,28.765; D-32 14.796,24.701; D-33 16.066,28.765; D-34 16.066,24.701; D-35 17.335,28.765; D-36 17.335,24.701; D-37 18.605,28.765; D-38 18.605,24.701; D-39 19.875,28.765; D-40 19.875,24.701 | smd 1.8 x 0.7 bottom: 4-1 -25.082,17.59; 4-2 -21.018,17.59; 4-3 -25.082,18.86; 4-4 -21.018,18.86; 4-5 -25.082,20.13; 4-6 -21.018,20.13; 4-7 -25.082,21.399; 4-8 -21.018,21.399; 4-9 -25.082,22.669; 4-10 -21.018,22.669; 4-11 -25.082,23.939; 4-12 -21.018,23.939; 4-13 -25.082,25.209; 4-14 -21.018,25.209; 4-15 -25.082,26.48; 4-16 -21.018,26.48; 4-17 -25.082,27.75; 4-18 -21.018,27.75; 4-19 -25.082,29.02; 4-20 -21.018,29.02 | hole 0.7: -11.239,20.384; 11.62,20.384; -3.619,-26.607; 19.241,-26.607; -3.619,26.733; 19.241,26.733; -23.05,18.224; -23.05,28.384
WE-TVS_MSOP-10L = smd 0.3 x 1.6: 1 -1,-2.05; 2 -0.5,-2.05; 3 0,-2.05; 4 0.5,-2.05; 5 1,-2.05; 6 1,2.05; 7 0.5,2.05; 8 0,2.05; 9 -0.5,2.05; 10 -1,2.05
MICRO-FIDUCIAL = smd 0.635 x 0.635: 1 0,0
FIDUCIAL-1X2 = smd 1 x 1: 1 0,0
JP2 = drill 0.914 long: 1 -2.54,0; 2 0,0; 3 2.54,0
AUDIO-JACK = drill 1.3 pad 2.184: RING 5,5; RSH 5,2.5; SLEEVE 0,0; TIP 5,-5; TSH 5,-2.5 | hole 1.2: 0,5; -2.5,5; -2.5,-5; 0,-5; 5,0
685119134923 = smd 0.28 x 2.6: 1 4.5,0; 2 4,0; 3 3.5,0; 4 3,0; 5 2.5,0; 6 2,0; 7 1.5,0; 8 1,0; 9 0.5,0; 10 0,0; 11 -0.5,0; 12 -1,0; 13 -1.5,0; 14 -2,0; 15 -2.5,0; 16 -3,0; 17 -3.5,0; 18 -4,0; 19 -4.5,0 | drill 0.9 pad 1.778 long: Z1 -7.25,-0.8; Z2 -7.25,-6.8; Z3 7.25,-6.8; Z4 7.25,-0.8
0805 = smd 1.2 x 1: 1 -1.2,0; 2 1.2,0
CHIPLED_0805 = smd 1.2 x 1.2: A 0,-1.05; C 0,1.05
SOT23 = smd 1 x 1.4: 1 -0.95,-1.1; 2 0.95,-1.1; 3 0,1.1
R0402 = smd 0.7 x 0.9: 1 -0.65,0; 2 0.65,0
4X0402ARV341 = smd 0.4 x 0.5: 1 -0.8,-0.5; 4 0.8,-0.5; 5 0.8,0.5; 8 -0.8,0.5 | smd 0.3 x 0.5: 2 -0.25,-0.5; 3 0.25,-0.5; 6 0.25,0.5; 7 -0.25,0.5
WESURGE_0402 = smd 0.9 x 0.65: 1 -0.7,0; 2 0.7,0
TACTILE-PTH = drill 1.016 pad 1.88: 1 -3.251,2.261; 2 3.251,2.261; 3 -3.251,-2.261; 4 3.251,-2.261
MA05-2 = drill 1.016 octagon: 1 -5.08,-1.27; 2 -5.08,1.27; 3 -2.54,-1.27; 4 -2.54,1.27; 5 0,-1.27; 6 0,1.27; 7 2.54,-1.27; 8 2.54,1.27; 9 5.08,-1.27; 10 5.08,1.27
TP06R = smd 0.6 x 0.6: TP 0,0
QFP50P1200X1200X160-65N = smd 1.473 x 0.279: 1 -5.715,3.759; 2 -5.715,3.251; 3 -5.715,2.743; 4 -5.715,2.261; 5 -5.715,1.753; 6 -5.715,1.245; 7 -5.715,0.762; 8 -5.715,0.254; 9 -5.715,-0.254; 10 -5.715,-0.762; 11 -5.715,-1.245; 12 -5.715,-1.753; 13 -5.715,-2.261; 14 -5.715,-2.743; 15 -5.715,-3.251; 16 -5.715,-3.759; 33 5.715,-3.759; 34 5.715,-3.251; 35 5.715,-2.743; 36 5.715,-2.261; 37 5.715,-1.753; 38 5.715,-1.245; 39 5.715,-0.762; 40 5.715,-0.254; 41 5.715,0.254; 42 5.715,0.762; 43 5.715,1.245; 44 5.715,1.753; 45 5.715,2.261; 46 5.715,2.743; 47 5.715,3.251; 48 5.715,3.759 | smd 0.279 x 1.473: 17 -3.759,-5.715; 18 -3.251,-5.715; 19 -2.743,-5.715; 20 -2.261,-5.715; 21 -1.753,-5.715; 22 -1.245,-5.715; 23 -0.762,-5.715; 24 -0.254,-5.715; 25 0.254,-5.715; 26 0.762,-5.715; 27 1.245,-5.715; 28 1.753,-5.715; 29 2.261,-5.715; 30 2.743,-5.715; 31 3.251,-5.715; 32 3.759,-5.715; 49 3.759,5.715; 50 3.251,5.715; 51 2.743,5.715; 52 2.261,5.715; 53 1.753,5.715; 54 1.245,5.715; 55 0.762,5.715; 56 0.254,5.715; 57 -0.254,5.715; 58 -0.762,5.715; 59 -1.245,5.715; 60 -1.753,5.715; 61 -2.261,5.715; 62 -2.743,5.715; 63 -3.251,5.715; 64 -3.759,5.715 | smd 5.105 x 5.105: 65 0,0
SON65P200X200X80-7N = smd 0.61 x 0.356: 1 -1.041,0.66; 2 -1.041,0; 3 -1.041,-0.66; 4 1.041,-0.66; 5 1.041,0; 6 1.041,0.66 | smd 0.991 x 1.6: 7 0,0
5MM_3.2MM = smd 1.9 x 1.1: P$1 -1.85,1.15; P$2 1.85,1.15; P$3 1.85,-1.15; P$4# -1.85,-1.15

### Placement (x,y rotation side)
C1  31.42,40.18 90 top
C2  24.31,40.18 270 top
C3  28.45,33.96 90 bottom
C4  29.79,33.96 90 bottom
C5  35.74,36.12 90 bottom
C6  34.47,36.12 90 bottom
C7  29.31,22.94 270 bottom
C8  27.99,22.94 270 bottom
C9  15.93,15.29 270 top
C10  29.64,31.93 180 bottom
C11  30.15,25.32 180 bottom
C12  31.17,26.59 180 bottom
C13  30.4,27.86 180 bottom
C14  31.42,29.13 180 bottom
C15  30.15,30.66 180 bottom
C16  37.01,35.61 90 bottom
C17  34.98,32.05 270 bottom
C18  33.71,32.05 270 bottom
C19  32.44,31.29 270 bottom
C20  36.5,27.99 0 bottom
C21  37.77,26.72 0 bottom
C22  35.23,24.43 90 bottom
C23  33.96,25.7 90 bottom
C24  30.66,22.4 270 bottom
C25  37.52,31.55 0 bottom
C26  36.75,29.77 0 bottom
C27  37.52,25.45 0 bottom
C28  37.52,23.42 0 bottom
C29  32.44,24.43 90 bottom
C30  19.99,43.48 90 top
C31  21.77,43.74 90 top
C32  25.07,15.29 270 top
C33  21.51,15.29 270 top
C34  8.81,15.29 270 top
C35  17.96,15.29 270 top
C36  13.89,15.29 270 top
C37  13.67,3.73 180 top
C38  7.44,5.16 270 top
C39  16.43,6.91 270 top
C40  28.12,3.61 90 top
C41  13.13,47.04 90 top
C42  13.13,51.36 90 top
CON1  38.02,29.77 0 top
D1  16.38,26.97 270 top
D2  23.14,30 270 top
D3  18.21,34.34 270 top
FID1  57.78,52.02 0 top
FID2  3.51,3.61 0 top
JP1  62.66,46.28 90 top
JP2  3.99,47.04 0 top
K1  10.24,30.28 270 top
L1  24.31,46.53 90 top
L2  23.29,15.29 270 top
L3  26.85,15.29 270 top
L4  10.59,15.29 270 top
L5  19.74,15.29 270 top
L6  12.12,15.29 270 top
LED1  4.24,56.69 0 top
LED2  2.72,56.69 180 top
LOGO1  52.6,21.69 0 top
Q1  17.2,42.98 180 top
Q2  17.7,38.91 180 top
Q3  11.86,57.2 90 top
Q4  8.56,54.91 90 top
R1  32.69,37.9 180 top
R2  33.71,20.12 270 top
R3  20.5,39.42 270 top
R4  14.15,6.65 90 top
R5  40.31,39.17 0 top
R6  37.26,39.17 180 top
R7  15.42,37.39 180 top
R8  51.99,31.55 90 top
R9  5.51,56.44 270 top
R10  1.45,56.44 90 top
R11  60.88,23.16 0 top
RN1  29.64,18.59 180 top
RN2  31.93,18.59 180 top
RN3  35.48,18.59 180 top
RN4  37.77,18.59 180 top
RN5  43.36,26.21 270 top
RN6  43.36,28.5 270 top
RN7  43.36,30.78 270 top
RN8  40.82,36.12 270 top
RV1  13.13,38.66 270 top
S1  60.63,18.08 270 top
SV1  58.85,32.56 270 top
TP1  44.75,30.28 0 top
TP2  29.64,54.66 0 top
U1  33.96,28.24 0 top
U2  11.35,6.65 0 top
U$1  [WEDIREKT]  36.65,51.18 0 top
U$2  [OLIMEXLIME]  28.73,10.44 0 top
Y1  27.86,40.18 180 top

### Tracks (layer width: path | path; a pad name or v marks a point on that pad's centre or on a via)
+5V  (via drill 0.3)
  Top 0.305: L1.2 24.31,49.07 v25.58,50.34
  Bottom 0.305: v25.58,50.34 26.09,50.85 26.09,52.12 CON1.1-1
ADV7611_INT  (via drill 0.3)
  Top 0.305: v35.99,37.9 35.99,37.64 34.72,36.37 U1.55 | v52.76,28.75 52.25,28.75 46.41,22.91 46.41,15.8 v45.9,15.29
  Bottom 0.305: CON1.3-7 37.58,11.29 39.55,13.26 43.61,13.26 45.64,15.29 v45.9,15.29 | v52.76,28.75 54.79,30.78 54.79,33.32 53.52,34.59 46.66,34.59 45.64,35.61 45.64,37.9 44.88,38.66 42.85,38.66 41.58,37.39 36.5,37.39 v35.99,37.9
ADV7611_RESET  (via drill 0.3)
  Top 0.305: v43.87,39.93 43.1,40.69 35.99,40.69 34.98,39.67 34.98,37.39 34.21,36.63 U1.56
  Bottom 0.305: v43.87,39.93 43.87,40.94 48.95,46.02 48.95,48.56 49.2,48.82 49.2,48.31 CON1.1-38
ADV7611_SCL  (via drill 0.3)
  Top 0.305: U1.53 35.71,35.84 37.52,37.64 39.04,37.64 39.55,38.15 | 39.55,38.15 39.55,39.05 R5.1 | 39.55,38.15 v40.31,38.15 | v53.01,46.79 51.23,46.79 48.18,49.83 v47.17,49.83
  Bottom 0.305: v40.31,38.15 41.07,38.91 41.07,41.71 41.58,42.21 43.61,42.21 47.68,46.28 47.68,48.06 CON1.1-36 47.68,48.18 47.68,49.07 47.17,49.58 v47.17,49.83 | JP1.2 53.52,46.28 v53.01,46.79
ADV7611_SDA  (via drill 0.3)
  Top 0.305: U1.54 35.2,36.09 37.26,38.15 37.52,38.15 37.77,38.4 37.77,39.02 R6.1 38.53,39.17 38.79,39.42 v38.79,39.93 | v46.41,50.34 47.42,51.36 50.47,51.36 51.49,50.34 51.49,48.31 51.99,47.8 v53.01,47.8
  Bottom 0.305: v46.41,50.34 46.41,48.18 CON1.1-34 46.47,46.09 43.1,42.72 41.07,42.72 40.06,41.71 40.06,40.69 39.8,40.44 39.29,40.44 v38.79,39.93 | JP1.3 58.85,48.82 57.84,47.8 v53.01,47.8
CEC  (via drill 0.3)
  Top 0.305: U1.61 31.7,36.35 30.66,37.39 v26.85,37.39 | v26.36,33.76 25.93,33.32 20.28,33.32 D3.6 19.62,33.34 19.3,33.02 17.04,33.02 16.74,33.32 16.18,33.32 D3.5 16.15,33.35 14.93,33.35 13.36,31.78 K1.13
  Bottom 0.305: v26.85,37.39 26.85,34.24 v26.36,33.76
CLK+
  Top 0.305: U1.4 D2.9 24.26,30.51 23.93,30.84 22.43,30.84 22.09,30.5 D2.2 12.03,30.5 11.81,30.28 K1.10
CLK-
  Top 0.305: U1.3 25.2,30.99 D2.10 24.5,31 24.16,31.34 22.22,31.34 21.87,30.99 21.1,30.99 D2.1 12.06,31 11.79,31.27 K1.12
CSI1_D0  (via drill 0.3)
  Top 0.305: RN6.8 44.92,29.3 46.91,31.29 46.91,41.2 44.88,43.23 34.47,43.23 33.71,43.99 v33.71,50.6
  Bottom 0.305: v33.71,50.6 33.71,52.12 CON1.1-13
CSI1_D1  (via drill 0.3)
  Top 0.305: RN6.7 45.13,28.75 47.42,31.04 47.42,41.45 45.14,43.74 35.48,43.74 34.72,44.5 34.72,50.34 v34.98,50.6
  Bottom 0.305: v34.98,50.6 34.98,52.12 CON1.1-15
CSI1_D2  (via drill 0.3)
  Top 0.305: RN6.6 45.39,28.25 47.93,30.78 47.93,41.71 45.39,44.25 37.01,44.25 36.25,45.01 v36.25,50.6
  Bottom 0.305: v36.25,50.6 36.25,52.12 CON1.1-17
CSI1_D3  (via drill 0.3)
  Top 0.305: RN6.5 45.61,27.7 48.44,30.53 48.44,41.96 45.64,44.75 38.02,44.75 37.52,45.26 v37.52,49.83
  Bottom 0.305: CON1.1-19 37.52,52.12 37.52,51.36 37.01,50.85 37.01,50.34 v37.52,49.83
CSI1_D4  (via drill 0.3)
  Top 0.305: RN5.8 45.68,27.01 48.95,30.28 48.95,42.21 45.9,45.26 39.04,45.26 38.28,46.02 v38.28,50.6
  Bottom 0.305: v38.28,50.6 38.79,51.1 38.79,52.12 CON1.1-21
CSI1_D5  (via drill 0.3)
  Top 0.305: RN5.7 45.89,26.46 49.45,30.02 49.45,42.47 46.15,45.77 39.8,45.77 39.29,46.28 v39.29,50.6
  Bottom 0.305: v39.29,50.6 40.06,51.36 40.06,52.12 CON1.1-23
CSI1_D6  (via drill 0.3)
  Top 0.305: RN5.6 46.16,25.96 49.96,29.77 49.96,42.72 46.41,46.28 40.82,46.28 40.31,46.79 v40.31,50.6
  Bottom 0.305: CON1.1-25 41.39,51.68 v40.31,50.6
CSI1_D7  (via drill 0.3)
  Top 0.305: RN5.5 46.37,25.41 50.47,29.51 50.47,42.98 46.66,46.79 41.83,46.79 41.33,47.29 v41.33,50.6
  Bottom 0.305: v41.33,50.6 42.34,50.6 42.6,50.85 42.6,52.12 CON1.1-27
CSI1_D8  (via drill 0.3)
  Top 0.305: RN4.8 39.3,18.09 39.55,18.34 39.55,22.4 41.33,24.18 45.9,24.18 50.98,29.26 50.98,41.45 v51.23,41.71
  Bottom 0.305: CON1.D-35 55.55,58.34 v55.55,56.95 55.55,56.18 55.8,55.93 56.57,55.93 56.82,55.68 57.58,55.68 57.84,55.93 58.34,55.93 58.6,55.68 58.6,51.1 57.58,50.09 54.03,50.09 52.5,48.56 52.25,48.56 51.49,47.8 51.49,41.96 v51.23,41.71
CSI1_D9  (via drill 0.3)
  Top 0.305: RN4.7 38.02,15.79 36.5,14.27 36.5,10.97 37.01,10.46 39.8,10.46 40.06,10.72 v40.06,11.23
  Bottom 0.305: v40.06,11.23 40.06,5.26 CON1.3-11
CSI1_D10  (via drill 0.3)
  Top 0.305: RN4.6 37.52,16.06 35.99,14.53 35.99,10.21 36.25,9.96 41.07,9.96 41.33,10.21 v41.33,10.72
  Bottom 0.305: v41.33,10.72 41.33,5.26 CON1.3-13
CSI1_D11  (via drill 0.3)
  Top 0.305: RN4.5 36.97,16.27 35.48,14.78 35.48,9.96 35.99,9.45 42.34,9.45 42.6,9.7 v42.6,10.21
  Bottom 0.305: v42.6,10.21 42.6,5.26 CON1.3-15
CSI1_D12  (via drill 0.3)
  Top 0.305: RN3.8 36.28,16.34 34.98,15.04 34.98,9.7 35.74,8.94 43.61,8.94 43.87,9.19 v43.87,9.7
  Bottom 0.305: v43.87,9.7 43.87,5.26 CON1.3-17
CSI1_D13  (via drill 0.3)
  Top 0.305: RN3.7 35.73,16.56 34.47,15.29 34.47,9.45 35.48,8.43 44.88,8.43 45.14,8.69 v45.14,9.19
  Bottom 0.305: v45.14,9.19 45.14,5.26 CON1.3-19
CSI1_D14  (via drill 0.3)
  Top 0.305: RN3.6 35.23,16.82 33.96,15.54 33.96,9.19 35.23,7.92 45.9,7.92 46.41,8.43 v46.41,8.94
  Bottom 0.305: v46.41,8.94 46.41,5.26 CON1.3-21
CSI1_D15  (via drill 0.3)
  Top 0.305: RN3.5 34.68,17.03 33.45,15.8 33.45,8.94 34.98,7.42 47.42,7.42 47.68,7.67 v47.68,8.18
  Bottom 0.305: v47.68,8.18 47.68,5.26 CON1.3-23
CSI1_D16  (via drill 0.3)
  Top 0.305: RN2.8 32.73,8.9 34.72,6.91 48.69,6.91 48.95,7.16 v48.95,7.42
  Bottom 0.305: v48.95,7.42 48.95,5.26 CON1.3-25
CSI1_D17  (via drill 0.3)
  Top 0.305: RN2.7 32.18,8.69 34.47,6.4 49.96,6.4 50.47,6.91 v50.47,7.16
  Bottom 0.305: v50.47,7.16 50.47,5.38 CON1.3-27
CSI1_D18  (via drill 0.3)
  Top 0.305: RN2.6 31.68,8.43 34.21,5.89 51.23,5.89 51.49,6.15 51.49,6.91 v51.74,7.16
  Bottom 0.305: v51.74,7.16 51.74,5.38 CON1.3-29
CSI1_D19  (via drill 0.3)
  Top 0.305: RN2.5 31.13,8.22 33.96,5.38 52.5,5.38 52.76,5.64 52.76,7.67 v53.01,7.92
  Bottom 0.305: v53.01,7.92 53.01,5.38 CON1.3-31
CSI1_D20  (via drill 0.3)
  Top 0.305: RN1.8 30.44,8.14 33.71,4.88 53.01,4.88 53.77,5.64 v53.77,7.16
  Bottom 0.305: 54.28,5.38 CON1.3-33 54.09,5.83 53.77,6.15 v53.77,7.16
CSI1_D21  (via drill 0.3)
  Top 0.305: RN1.7 29.89,7.93 33.45,4.37 53.77,4.37 54.53,5.13 v54.53,7.92
  Bottom 0.305: 55.55,5.38 CON1.3-35 55.36,5.83 54.53,6.65 v54.53,7.92
CSI1_D22  (via drill 0.3)
  Top 0.305: RN1.6 29.39,7.67 33.2,3.86 33.2,3.1 33.96,2.34 34.98,2.34 35.48,2.84 35.48,3.61 35.74,3.86 54.28,3.86 55.3,4.88 v55.3,7.16
  Bottom 0.305: 56.82,5.38 CON1.3-37 | CON1.3-37 56.63,5.83 | CON1.3-37 56.63,6.08 56.06,6.65 55.8,6.65 v55.3,7.16
CSI1_D23  (via drill 0.3)
  Top 0.305: RN1.5 28.84,7.45 32.69,3.61 32.69,2.84 33.71,1.83 35.23,1.83 35.99,2.59 35.99,3.1 36.25,3.35 54.53,3.35 56.06,4.88 v56.06,7.67
  Bottom 0.305: 57.84,5.13 CON1.3-39 57.84,5.26 57.84,7.16 57.33,7.67 v56.06,7.67
CSI1_FIELD  (via drill 0.3)
  Top 0.305: R8.1 51.99,29.51 44.88,22.4 44.88,14.78 46.91,12.75 56.31,12.75 v58.34,10.72
  Bottom 0.305: CON1.3-36 55.3,1.19 55.3,2.34 55.55,2.59 56.57,2.59 56.82,2.34 57.58,2.34 58.6,3.35 58.6,6.4 58.34,6.65 v58.34,10.72
CSI1_HSYNC  (via drill 0.3)
  Top 0.305: v31.17,50.34 31.17,44.25 33.2,42.21 44.37,42.21 45.9,40.69 45.9,31.8 45.13,31.03 RN7.7
  Bottom 0.305: CON1.1-9 31.23,50.41 v31.17,50.34
CSI1_MLCK  (via drill 0.3)
  Top 0.305: TP2.TP 29.64,54.03 v29.9,53.77
  Bottom 0.305: v29.9,53.77 29.9,52.25 CON1.1-7
CSI1_PCLK  (via drill 0.3)
  Top 0.305: R2.2 v33.71,18.59
  Bottom 0.305: v33.71,18.59 33.45,18.85 26.85,18.85 25.83,19.86 25.83,21.13 25.32,21.64 25.32,24.69 25.83,25.2 25.83,32.31 26.09,32.56 26.59,32.56 27.61,33.58 27.61,44.75 26.85,45.52 25.83,45.52 25.07,46.28 25.07,49.07 25.32,49.33 27.1,49.33 27.36,49.58 28.12,49.58 28.69,50.15 CON1.1-5
CSI1_VSYNC  (via drill 0.3)
  Top 0.305: v32.69,50.6 31.67,51.61 30.4,51.61 29.9,51.1 29.9,49.33 30.4,48.82 30.4,44.25 32.94,41.71 44.12,41.71 45.39,40.44 45.39,33.58 | 45.39,33.58 45.39,32.05 44.88,31.55 43.9,31.55 RN7.8 | R8.2 v51.99,33.32 | v44.88,33.07 45.39,33.58
  Bottom 0.305: CON1.1-11 32.5,50.79 v32.69,50.6 | v51.99,33.32 45.14,33.32 v44.88,33.07
CVDD_1V8  (via drill 0.3, 0.51)
  Top 0.305: U1.14 26.9,25.5 26.09,24.69 v26.09,24.18 | U1.2 26.9,31.5 v26.59,31.8
  Top 0.406: L5.1 18.21,16.49 C35.1 17.86,16.14 C9.1
  Top 0.61: v17.96,17.83 C35.1
  Route15 0.406: v17.96,17.83 17.96,18.34 22.02,22.4 24.56,22.4 26.09,23.93 v26.09,24.18 27.36,25.45 28.63,25.45 | v26.59,31.8 29.13,31.8
  Route15 0.61: 28.63,26.47 28.63,25.45
  Bottom 0.305: v26.09,24.18 26.68,23.59 C8.1 C7.1 | 26.85,32.05 v26.59,31.8 28.1,33.31 C3.1 C4.1
  pour Route15 (no thermals): 28.37,34.59 39.55,34.59 39.67,22.4 28.24,22.28
DDC_SCL  (via drill 0.3)
  Top 0.305: U1.62 31.22,35.81 30.15,36.88 28.12,36.88 27.86,36.63 v25.83,36.63 | v25.45,34.11 25.17,33.83 20.27,33.83 D3.7 19.23,33.83 18.9,33.5 17.45,33.5 17.11,33.84 D3.4 14.41,33.84 13.35,32.78 K1.15
  Bottom 0.305: v25.83,36.63 25.83,34.49 v25.45,34.11
DDC_SDA
  Top 0.305: U1.63 30.71,35.56 29.9,36.37 28.37,36.37 27.86,35.86 24.82,35.86 23.79,34.84 D3.9 20.25,34.85 19.25,34.85 18.85,35.25 17.5,35.25 17.09,34.84 D3.2 16.15,34.85 14.4,34.85 12.83,33.28 K1.16
DVDD_1V8  (via drill 0.3)
  Top 0.305: U1.52 36.22,32.59 v36.25,32.56 | U1.40 v38.28,27.99 | U1.24 33.71,23.67 v33.96,23.93 | U1.60 32.21,32.84 31.93,32.56 v31.42,32.56
  Top 0.406: v26.85,20.62 26.85,19.61 26.09,18.85 9.58,18.85 8.81,18.08 C34.1 9.06,16.49 L4.1
  Route15 0.406: v36.25,32.56 38.53,32.56 39.29,31.8 39.29,28.24 39.04,27.99 | 39.04,27.99 v38.28,27.99 | v33.96,23.93 33.96,23.42 | 33.96,23.42 33.96,23.16 34.72,22.4 38.79,22.4 39.55,23.16 39.55,27.48 39.04,27.99 | v26.85,20.62 27.1,20.62 27.86,19.86 31.67,19.86 32.69,20.88 32.69,22.15 33.96,23.42
  Bottom 0.305: C23.1 v33.96,23.93 34.1,23.78 C22.1 | C20.1 v38.28,27.99 38.42,27.85 C21.1 | v31.42,32.56 31.82,32.56 C19.1 33.2,32.7 C18.1 C17.1 36.1,32.7 v36.25,32.56 36.22,32.59 U1.52 37.01,34.75 C16.1
DVDDIO_3V3  (via drill 0.3, 0.51)
  Top 0.305: U1.23 33.2,23.67 32.69,24.18 v31.42,24.18 | U1.44 38.3,30 v38.28,30.02 | U1.34 38.33,24.99 38.28,24.94 v38.28,24.43
  Top 0.406: v25.09,17.91 25.07,17.88 C32.1 25.32,16.49 L3.1 | v31.42,24.18 31.42,24.43 31.93,24.94 37.77,24.94 | 37.77,24.94 v38.28,24.43 | v38.28,30.02 38.02,30.02 37.52,29.51 37.52,25.2 37.77,24.94
  Top 0.61: L3.1 26.85,16.87 v27.89,17.91
  Route15 0.406: v25.09,17.91 25.58,18.39 25.58,21.13 26.85,22.4 29.64,22.4 v31.42,24.18
  Bottom 0.305: v38.28,30.02 38.28,31.55 C25.1 | v38.28,30.02 37.77,30.02 | C28.1 38.17,24.32 v38.28,24.43 | C29.1 32.04,24.18 v31.42,24.18 30.66,23.42 C24.1 | C26.1 38.02,29.77 v38.28,30.02
  Bottom 0.406: C27.1 38.17,24.55 v38.28,24.43 38.28,25.45
  pour Route15 (rank 2, no thermals): 29.13,52.12 29.13,47.04 27.61,47.04 27.61,37.01 34.34,37.01 34.34,35.1 40.18,35.1 40.18,21.89 27.61,21.89 27.61,0.05 64.69,0.05 64.69,59.49 36.25,59.49 36.25,52.12
GND  (via drill 0.3, 0.51)
  Top 0.305: U2.5 13.13,6.65 13.39,6.4 13.39,4.85 12.85,4.32 12.85,3.77 C37.2 12.81,2.73 v12.88,2.67 | Q3.2 11.93,58.15 v11.35,58.72 | Q4.2 11.03,55.86 v11.1,55.93 | RV1.1 11.92,39.36 v11.86,39.42 | D3.8 v18.67,34.34 | Q2.2 15.56,40.01 v15.52,40.06 | K1.11 v8.31,30.78 | K1.8 8.32,29.28 v8.31,29.26 | K1.5 8.35,27.78 v8.31,27.74 | K1.2 8.37,26.28 v8.38,25.81 | K1.17 8.11,33.78 v8.05,33.4 | D1.8 v16.84,26.97 | D2.8 v23.6,30 | 16.48,4.57 v16.43,4.62 | Q1.2 15.13,44.08 v15.01,44.2
  Top 0.406: C34.2 v8.81,13 | C36.2 v13.89,13 | C9.2 v15.93,13 | C35.2 v17.96,13 | C33.2 v21.51,13 | C32.2 v25.07,13 | C38.2 v7.44,2.84
  Top 0.61: v32.69,1.07 v31.67,1.07 28.86,1.07 C40.- | C39.2 v16.43,4.62 | v22.86,44.5 22.75,44.39 C31.2 21.72,44.43 C30.2 | v19.96,45.87 19.96,44.37
  Bottom 0.305: v36.75,2.59 35.23,2.59 34.98,2.34 34.98,1.19 CON1.3-4 CON1.3-2 32.75,1.13 v32.69,1.07 v31.67,1.07 | CON1.1-2 26.15,46.6 v26.09,46.53 | CON1.D-4 CON1.D-2 32.75,54.47 v32.69,54.41 v31.67,54.41 | CON1.4-2 18.4,47.36 v18.47,47.29 | v28.12,21.13 27.99,21.26 C8.2 C7.2 | 29.9,34.59 29.9,34.85 v29.13,35.61 28.37,34.85 28.37,34.59 | v34.21,37.9 34.47,37.64 C6.2 C5.2 36.5,36.77 C16.2
  other vias: 32.94,29.26 33.96,29.26 34.98,29.26 32.94,28.24 33.96,28.24 34.98,28.24 32.94,27.23 33.96,27.23 34.98,27.23 11.35,7.16 11.35,6.15 0.94,58.72 5.26,58.72 7.54,58.72 9.07,58.72 25.83,58.72 28.88,58.72 31.93,58.72 63.42,41.45 63.42,12.5 63.42,9.7 17.2,1.07 14.15,1.07 11.1,1.07 8.05,1.07 5,1.07 1.96,1.07 0.94,3.35 0.94,6.15 0.94,8.94 0.94,11.73 0.94,14.78 0.94,18.08 0.94,21.13 0.94,24.43 0.94,27.23 0.94,30.02 0.94,32.82 0.94,35.61 0.94,38.4 0.94,40.18 0.94,43.99 0.94,47.04 0.94,50.09 0.94,53.9 24.56,37.9 25.32,37.9 26.09,37.9 25.32,42.47 26.09,42.47 26.85,42.47 28.37,42.47 29.13,42.47 29.9,42.47 38.53,35.1 39.55,35.1 25.83,0.81 63.42,50.6 63.42,23.42 17.45,19.86 24.05,19.61 24.82,20.62 21.77,20.62 22.53,21.39 18.21,20.62 18.97,21.39 19.74,22.15 34.21,40.69 33.45,40.69 56.06,14.02 53.01,14.02 49.71,14.02 47.42,14.02 47.17,17.07 47.17,19.35 47.17,21.89 48.95,23.67 50.72,25.45 52.5,27.23 55.04,28.5 58.6,45.01 58.6,47.55 57.96,49.07 54.03,9.19 51.99,9.19 49.96,9.19 40.31,20.12 40.31,17.58 38.02,14.02 39.04,16.05 40.56,15.04 42.85,11.99 41.07,11.99 18.57,32.21 17.32,32.21 60.12,9.7 22.12,32.46 14.76,32.21 37.52,56.44 39.55,56.44 42.09,56.44 44.63,56.44 47.17,56.44 49.71,56.44 52.25,56.44 54.53,56.44 55.55,36.37 55.55,33.83 55.55,31.29 61.9,31.55 61.65,33.83 61.39,24.94 61.9,28.75 12.75,24.59 14.78,24.59 16.81,24.59 18.85,24.59 20.88,24.59 24.43,24.59 40.82,33.83 40.82,32.82 43.36,37.9 42.85,39.42 35.48,44.75 35.48,46.28 32.44,46.53 32.44,45.26 33.45,42.98 11.61,5.13 10.85,5.13 10.08,5.13 10.08,4.37 10.85,4.37 11.61,4.37 10.59,8.18 11.35,8.18 12.12,8.18 12.12,8.94 11.35,8.94 10.59,8.94 24.56,10.46 25.58,10.46 25.58,8.94 23.04,8.94 24.56,8.94 44.12,21.39 44.12,19.35 44.12,17.07 45.64,17.07 45.64,19.35 45.64,21.39 44.12,15.29 54.28,38.66 56.31,38.66 54.28,41.2
  pour Route2 (no thermals): -0.03,59.56 64.64,59.56 64.64,0 -0.03,0
  pour Bottom (no thermals): 30.23,32.79 37.21,32.79 37.21,23.98 30.23,23.98
  pour Top (no thermals): -0.08,59.49 64.69,59.49 64.69,0.05 -0.08,0.05
  pour Bottom (no thermals): -0.03,59.54 64.62,59.54 64.62,0 -0.03,0
GPIO2  (via drill 0.3)
  Top 0.305: v15.42,53.64 13.89,53.64 13.57,53.96 Q4.1
  Bottom 0.305: CON1.4-12 15.73,53.71 v15.42,53.64
GPIO3  (via drill 0.3)
  Top 0.305: v15.42,55.17 14.04,55.17 Q3.1
  Bottom 0.305: CON1.4-14 15.61,54.98 v15.42,55.17
HDMI_5V  (via drill 0.3)
  Top 0.254: R7.2 14.77,38.42 v14.71,38.48 | v20.52,37.64 20.52,38.75 R3.2
  Top 0.305: K1.18 8.62,34.28 8.25,34.65 8.25,35.66 8.76,36.17 12.75,36.17 13.13,36.55 RV1.2 13.5,37.96 14.12,37.34 14.72,37.34 R7.2 | U1.64 30.2,34.54 30,34.34 28.88,34.34 28.24,34.98 v25.02,34.98
  Bottom 0.254: v14.71,38.48 19.68,38.48 v20.52,37.64
  Bottom 0.305: v25.02,34.98 25.02,35.05 22.45,37.62 20.55,37.62 v20.52,37.64
HOT_PLUG_DETECT  (via drill 0.3)
  Top 0.305: 28.19,32.05 U1.1 27.66,32 27.1,32.56 v24.31,32.56 | 16.15,35.36 14.15,35.36 13.57,34.78 K1.19 | 16.15,35.36 D3.1 16.9,35.34 17.37,35.81 19.18,35.81 19.63,35.36 20.28,35.36 | 20.28,35.36 D3.10 | Q2.3 17.62,37.81 17.2,37.39 R7.1 16.15,37.31 16.15,35.36 | 20.28,35.36 22.48,35.36 v22.83,35.71
  Bottom 0.305: v24.31,32.56 24.31,34.24 v22.83,35.71
I2S_BCLK  (via drill 0.3)
  Top 0.305: RN8.6 42.34,35.87 v42.6,35.61 | v42.09,21.89 42.09,14.78 45.9,10.97 55.3,10.97 57.33,8.94 57.33,4.62 55.04,2.34 47.93,2.34 47.42,1.83 46.15,1.83 45.39,2.59 v43.36,2.59
  Bottom 0.305: v43.36,2.59 43.36,3.35 43.1,3.61 40.56,3.61 40.06,3.1 40.06,1.19 CON1.3-12 | v42.6,35.61 42.6,23.93 42.09,23.42 v42.09,21.89
I2S_DI  (via drill 0.3)
  Top 0.305: v41.33,22.66 41.33,14.78 45.64,10.46 55.04,10.46 56.82,8.69 56.82,4.88 54.79,2.84 47.68,2.84 47.42,2.59 v46.41,2.59 | RN8.5 41.32,35.11 v41.83,34.59
  Bottom 0.305: v46.41,2.59 46.41,1.19 CON1.3-22 | v41.33,22.66 41.33,23.67 41.83,24.18 v41.83,34.59
I2S_LRCK  (via drill 0.3)
  Top 0.305: RN8.7 43.11,36.37 v43.36,36.12 | v41.33,2.59 41.39,2.53 42.4,2.53 43.36,1.57 45.64,1.57 45.9,1.32 47.68,1.32 48.18,1.83 57.07,1.83 57.96,2.72 57.96,9.07 55.55,11.48 46.15,11.48 42.85,14.78 v42.85,22.66
  Bottom 0.254: v43.36,36.12 43.36,23.16 v42.85,22.66
  Bottom 0.305: v41.33,2.59 41.33,1.19 CON1.3-14
I2S_MCLK  (via drill 0.3)
  Top 0.305: RN8.8 44.08,36.92 v44.12,36.88 | v38.79,2.59 40.31,2.59 41.07,1.83 42.34,1.83 43.1,1.07 45.39,1.07 45.64,0.81 47.93,0.81 48.44,1.32 57.33,1.32 58.47,2.46 58.47,9.32 55.8,11.99 46.41,11.99 43.36,15.04 43.36,22.15 v43.87,22.66
  Bottom 0.254: v44.12,36.88 44.12,22.91 v43.87,22.66
  Bottom 0.305: v38.79,2.59 38.79,1.19 CON1.3-10
LINEINL  (via drill 0.3)
  Top 0.305: v14.91,49.83 14.91,49.07 14.4,48.56 13.71,48.56 C41.2
  Bottom 0.305: CON1.4-15 14.34,56.25 14.4,56.18 14.4,50.34 v14.91,49.83
LINEINR  (via drill 0.3)
  Top 0.305: v11.1,52.63 12.81,52.63 C42.2
  Bottom 0.305: CON1.4-13 11.42,54.98 11.1,54.66 v11.1,52.63
N$1
  Top 0.305: K1.1 11.86,25.78 12.04,25.96 14.32,25.96 D1.5 15.02,25.97 15.34,25.65 17.12,25.65 17.42,25.96 18.42,25.96 D1.6 28.24,25.97 U1.13
N$2
  Top 0.305: K1.3 11.75,26.78 12.06,26.47 14.32,26.47 D1.4 15.43,26.47 15.8,26.11 16.92,26.11 17.28,26.47 D1.7 18.45,26.49 U1.12
N$3
  Top 0.305: U1.10 D1.9 17.46,27.47 17.09,27.84 15.67,27.84 15.31,27.47 D1.2 12.03,27.47 11.84,27.28 K1.4
N$4
  Top 0.305: K1.6 11.75,28.28 12.04,27.99 14.32,27.99 D1.1 14.92,27.97 15.29,28.35 17.32,28.35 17.68,27.99 18.45,27.99 | U1.9 18.45,27.99 | 18.45,27.99 D1.10
N$5
  Top 0.305: U1.7 25.2,29.01 | 25.2,29.01 D2.6 | K1.7 11.79,28.78 12,29 D2.5 21.1,29.01 21.67,29.01 22,28.68 24.16,28.68 24.49,29.01 25.2,29.01
N$6
  Top 0.305: U1.6 28.22,29.51 25.21,29.51 D2.7 24.16,29.49 23.82,29.16 22.38,29.16 22.04,29.5 D2.4 12.03,29.5 11.76,29.77 K1.9
N$7
  Top 0.305: RN1.4 28.84,22.44 27.61,23.67 27.1,23.67 26.85,23.93 26.85,24.69 27.1,24.94 28.19,24.94 U1.15
N$8
  Top 0.305: RN1.3 29.39,22.91 28.37,23.93 28.37,24.36 U1.16
N$9
  Top 0.305: U1.17 30.2,21.18 29.89,20.87 RN1.2
N$10
  Top 0.305: RN1.1 30.44,20.41 30.71,20.68 U1.18
N$11
  Top 0.305: U1.19 31.22,20.42 31.13,20.33 RN2.4
N$12
  Top 0.305: U1.20 31.7,19.11 RN2.3
N$13
  Top 0.305: RN2.2 32.18,21.13 32.21,21.16 U1.21
N$14
  Top 0.305: U1.22 32.71,19.11 RN2.1
N$15
  Top 0.254: RN3.4 34.68,21.5 34.75,21.56 34.75,22.5 U1.26
N$16
  Top 0.254: U1.27 35.2,19.89 35.23,19.86 RN3.3
N$17
  Top 0.254: U1.28 35.71,19.11 RN3.2
N$18
  Top 0.305: U1.29 36.22,19.16 RN3.1
N$19
  Top 0.305: U1.30 36.7,19.91 36.97,19.65 RN4.4
N$20
  Top 0.305: RN4.3 37.52,19.86 37.21,20.17 U1.31
N$21
  Top 0.305: RN4.2 38.02,20.37 37.72,20.68 U1.32
N$22
  Top 0.305: U1.33 39.67,23.29 38.57,22.19 RN4.1
N$23
  Top 0.305: RN5.4 41.62,25.41 41.53,25.5 U1.35
N$24
  Top 0.305: U1.36 42.32,25.98 42.34,25.96 RN5.3
N$25
  Top 0.305: RN5.2 39.7,26.46 U1.37
N$26
  Top 0.305: U1.38 42.84,27 RN5.1
N$27
  Top 0.305: U1.39 41.58,27.48 41.83,27.74 42.82,27.74 RN6.4
N$28
  Top 0.305: RN6.3 41.32,28.25 41.07,28.5 U1.41
N$29
  Top 0.305: U1.42 41.58,29.01 41.83,28.75 RN6.2
N$30
  Top 0.305: RN6.1 42.13,29.3 42.09,29.26 41.86,29.49 U1.43
N$31
  Top 0.305: U1.48 39.67,33.96 40.32,34.6 RN8.4
N$32
  Top 0.305: U1.46 42.04,30.99 42.09,31.04 42.09,31.03 RN7.2
N$33
  Top 0.305: U1.45 42.83,30.51 RN7.3
N$34
  Top 0.305: U1.25 34.21,21.27 R2.1
N$35
  Top 0.305: U1.49 37.72,35.56 38.03,35.87 RN8.3
N$36
  Top 0.61: Q1.3 18.65,40.42 Q2.1 18.71,40.07 R3.1
N$37
  Top 0.305: U1.50 37.21,35.81 37.77,36.37 RN8.2
N$38
  Top 0.305: RN8.1 37.55,36.92 36.7,36.07 U1.51
N$39  (via drill 0.3)
  Top 0.305: R4.1 v14.15,5.11 14.15,4.95 14.55,4.55 14.55,3.77 C37.1 | U2.3 9.42,5.99 v9.07,5.64
  Bottom 0.305: v9.07,5.64 9.07,4.11 9.58,3.61 13.39,3.61 14.15,4.37 v14.15,5.11
N$40
  Top 0.305: 10.76,57.28 Q3.3 7.8,57.2 7.04,57.96 6.27,57.96 6.05,57.74 LED1.C
N$41
  Top 0.305: R9.2 4.39,55.79 LED1.A
N$43
  Top 0.305: LED2.A 2.1,57.74 R10.2
N$44
  Top 0.305: LED2.C 2.72,54.66 2.97,54.41 6.95,54.41 Q4.3
N$45
  Top 0.305: C42.1 10.62,50.41 JP2.RING
N$46
  Top 0.305: C41.1 11.67,46.09 11.1,45.52 11.1,44.15 JP2.TIP
N$47
  Top 0.305: RN7.6 44.5,30.53 TP1.TP
PB2/PWM0  (via drill 0.3)
  Top 0.305: v56.31,52.88 55.8,52.37 55.8,45.77 58.09,43.48 58.09,42.21 59.11,41.2 61.39,41.2 63.42,39.17 63.42,25.45 61.53,23.56 R11.2 61.53,22.01 62.15,21.39 63.35,21.39 S1.1
  Bottom 0.305: v56.31,52.88 55.8,52.88 55.3,53.39 55.3,54.41 CON1.D-36
PVDD_1V8  (via drill 0.3, 0.51)
  Top 0.305: U1.57 33.71,35.61 v33.45,35.86
  Top 0.406: v13.89,17.88 C36.1 13.64,16.49 L6.1
  Route15 0.406: v13.89,17.88 19.18,23.16 24.05,23.16 27.1,26.21 27.1,30.53 26.85,30.78 26.09,30.78 25.58,31.29 25.58,32.05 26.09,32.56 26.85,32.56 27.1,32.82 27.1,35.61 27.86,36.37 32.94,36.37 v33.45,35.86
  Bottom 0.305: v33.45,35.86 33.85,35.47 C6.1 C5.1
SPI2_CLK  (via drill 0.3)
  Top 0.305: SV1.6 62.15,32.56 62.41,32.82 62.41,38.66 61.14,39.93 58.09,39.93 55.55,42.47 55.55,43.74 54.79,44.5 54.79,50.34 54.03,51.1 v53.52,51.1
  Bottom 0.305: CON1.1-35 47.74,50.28 48.67,49.35 51.76,49.35 v53.52,51.1
SPI2_CS0  (via drill 0.3)
  Top 0.305: SV1.8 61.9,30.02 62.92,31.04 62.92,38.91 61.39,40.44 58.34,40.44 56.06,42.72 56.06,43.99 55.3,44.75 55.3,50.85 53.01,53.14 46.66,53.14 v44.12,50.6
  Bottom 0.305: CON1.1-33 46.41,52.12 46.41,51.36 45.64,50.6 v44.12,50.6
SPI2_MISO  (via drill 0.3)
  Top 0.305: SV1.2 60.12,37.9 59.11,38.91 57.58,38.91 54.53,41.96 54.53,43.23 53.77,43.99 53.77,48.82 52.25,50.34 v52.25,52.37
  Bottom 0.305: v52.25,52.37 50.47,52.37 CON1.1-39
SPI2_MOSI  (via drill 0.3)
  Top 0.305: SV1.4 61.39,35.1 61.9,35.61 61.9,38.4 60.88,39.42 57.84,39.42 55.04,42.21 55.04,43.48 54.28,44.25 54.28,49.33 53.77,49.83 53.52,49.83 52.76,50.6 52.76,51.61 v53.01,51.87
  Bottom 0.305: CON1.1-37 48.95,52.12 48.95,51.1 49.1,50.95 52.1,50.95 v53.01,51.87
TVDD_3V3  (via drill 0.3, 0.51)
  Top 0.305: U1.5 29.16,30 v29.64,29.51 29.63,28.49 | U1.11 29.62,27 | 29.62,27 v29.64,26.72 | 29.62,27 29.63,28.49 | U1.8 29.63,28.49
  Top 0.406: v21.51,17.83 C33.1 21.76,16.49 L2.1
  Route15 0.406: 21.51,18.85 v21.51,17.83 | v29.64,26.72 29.64,24.94 28.37,23.67 27.1,23.67 26.85,23.42
  Bottom 0.305: v29.64,29.51 29.5,29.66 C15.1 28.99,31.17 C10.1 | 29.26,29.9 v29.64,29.51 | C13.1 29.75,26.83 v29.64,26.72 | C12.1 29.77,26.59 v29.64,26.72 | C11.1 29.5,26.83 v29.64,26.72 | v29.64,29.51 30.39,29.51 C14.1 | v29.64,29.51 29.64,27.99
  Bottom 0.61: v23.8,21.39 23.8,23.42 v23.04,24.18 | v21.01,19.86 20.75,19.86 20.5,19.61 18.47,19.61 17.7,18.85 15.16,18.85 v13.89,20.12
  pour Route15 (rank 2): 7.54,45.52 27.1,45.52 27.1,18.08 7.54,18.08
TWI2_SCL  (via drill 0.3)
  Top 0.305: SV1.1 54.28,37.64 53.52,38.4 53.52,42.98 47.68,48.82 45.64,48.82 45.14,49.33 v45.14,49.83
  Bottom 0.305: v45.14,49.83 45.14,48.18 CON1.1-32
TWI2_SDA  (via drill 0.3)
  Top 0.305: v44.12,49.58 44.12,48.56 44.37,48.31 47.42,48.31 53.01,42.72 53.01,36.37 54.28,35.1 SV1.3
  Bottom 0.305: CON1.1-30 43.93,49.39 v44.12,49.58
UART0_RX  (via drill 0.3)
  Top 0.305: SV1.7 54.53,30.02 53.01,31.55 53.01,33.83 51.99,34.85 51.99,42.21 46.91,47.29 42.34,47.29 41.83,47.8 41.83,48.56 42.09,48.82 v42.09,49.58
  Bottom 0.305: CON1.1-26 41.39,48.88 v42.09,49.58
UART0_TX  (via drill 0.3)
  Top 0.305: SV1.5 55.04,32.56 52.5,35.1 52.5,42.47 47.17,47.8 43.36,47.8 43.1,48.06 v43.1,49.83
  Bottom 0.305: v43.1,49.83 43.1,49.58 42.85,49.33 42.85,48.31 CON1.1-28
VCC  (via drill 0.3, 0.51)
  Top 0.254: 60.12,23.28 R11.1 | D3.3 v17.7,34.34
  Top 0.305: SV1.10 60.12,23.28 | R4.2 | v16.43,9.45 C39.1 | v6.53,57.2 5.62,57.2 R9.1 | R10.1 v1.45,54.91 | R6.2 v35.74,39.17 | R5.2 v41.83,39.17 | D1.3 v15.9,26.97 | D2.3 v22.71,30 | U2.4 12.78,5.99 12.88,5.89 12.88,5.38 v12.62,5.13
  Top 0.406: R4.2 15.56,7.3 15.93,7.67 16.25,7.67 C39.1 | U2.6 R4.2
  Top 0.61: v30.4,3.61 30.4,4.62 29.64,5.38 28.39,5.38 C40.+ 27.86,5.66 27.86,6.15 26.83,7.18 26.59,7.18 26.59,11.48 | L2.2 23.29,12.24 24.05,11.48 | 24.05,11.48 26.59,11.48 | L3.2 26.85,11.73 26.59,11.48 | C39.1 16.62,7.86 17.96,9.19 21.77,9.19 24.05,11.48 | v26.09,6.15 26.09,6.65 26.59,7.16
  Route15 0.305: 26.85,46.02 27.1,46.28 29.9,46.28 31.67,44.5 31.67,40.94 33.45,39.17 v35.74,39.17 v41.83,39.17 | 27.66,53.34 v27.36,53.64
  Route15 0.406: 4.5,26.47 4.65,26.62 15.54,26.62 v15.9,26.97 | 6.27,34.34 v17.7,34.34 17.7,33.32 17.96,33.07 18.97,33.07 21.97,30.07 22.63,30.07 v22.71,30
  Route15 0.61: SV1.10 62.41,27.48 62.92,27.99 62.92,39.67 60.63,41.96 60.63,50.09 58.6,50.09 58.09,50.6 58.09,53.39 57.07,54.41 54.03,54.41 53.52,54.91 53.52,57.96 52.76,58.72 35.74,58.72 | 34.21,58.22 v35.48,56.95
  Bottom 0.254: v27.36,53.64 27.36,52.25 CON1.1-3
  Bottom 0.305: v16.43,9.45 15.16,8.18 13.39,8.18 12.88,7.67 12.88,5.38 v12.62,5.13
  Bottom 0.61: CON1.3-3 35.04,7.1 34.47,7.67 31.67,7.67 31.17,7.16 31.17,4.37 v30.4,3.61 | CON1.D-3 35.04,57.39 v35.48,56.95
  Bottom 0.813: CON1.4-1 11.42,47.36 v11.35,47.29
  pour Route15: -0.08,59.49 35.74,59.49 35.74,52.63 28.63,52.63 28.63,47.55 27.1,47.55 27.1,46.02 7.04,46.02 7.04,17.58 27.1,17.58 27.1,0.05 -0.08,0.05
VDD_1V8
  Top 0.406: 10.59,11.71 L4.2 L6.2 | L5.2 19.74,12.75 18.72,11.73 10.62,11.73 10.59,11.71 | U2.1 8.81,7.31 | 8.81,7.31 8.65,7.31 C38.1 | 8.81,7.31 8.64,7.49 8.64,10.62 9.32,11.3 10.19,11.3 10.59,11.71
VDD_5V
  Top 0.61: L1.1 24.31,43.61 23.88,43.18 21.86,43.18 C31.1 21.42,43.09 20.88,42.54 20,42.54 C30.1 19.93,42.6 19.35,42.6 18.15,43.8 Q1.1
VS_FIELD
  Top 0.305: U1.47 41.53,31.5 41.62,31.58 RN7.1
XTALN
  Top 0.305: C2.1 24.81,41.33 Y1.P$3 26.15,41.2 27.36,41.2 27.86,40.69 27.86,38.4 28.37,37.9 R1.2 32.18,37.75 32.18,35.36 32.71,34.82 U1.59
XTALP
  Top 0.305: 33.45,37.78 R1.1 | R1.1 33.34,38.77 32.69,39.42 31.53,39.42 C1.1 30.79,39.53 30.4,39.14 29.82,39.14 Y1.P$1 | U1.58 33.2,35.1 32.69,35.61 32.69,36.88 33.2,37.39 33.2,37.75 R1.1

### Text on the board
Top: CC-BY-SA 3.0 | by OTELOeGen / 2014 | VideoBrick / ALPHA 4
tPlace: supported by:
tNames: TEAM: / Gabriel Lucas / Georg Lippitsch / Georg Ottinger